# EAGLE schematic MainBoard (EAGLE 6.4)
AUTHOR: Sandor Szilvasi; AUTHOREMAIL: sandor.szilvasi@vanderbilt.edu; PAGE1: Cover page; PAGE10: Connectors; PAGE2: SF supply pins; PAGE3: Clock, reset, JTAG; PAGE4: SF AFE; PAGE5: External AFE #1; PAGE6: External AFE #2; PAGE7: Ethernet; PAGE8: USB and AFE dig.; PAGE9: I/O signals; REVISION: B; TITLE: Teton; VERIFIER: Peter Volgyesi; VERIFIEREMAIL: peter.volgyesi@vanderbilt.edu

## Sheet 1 of 10
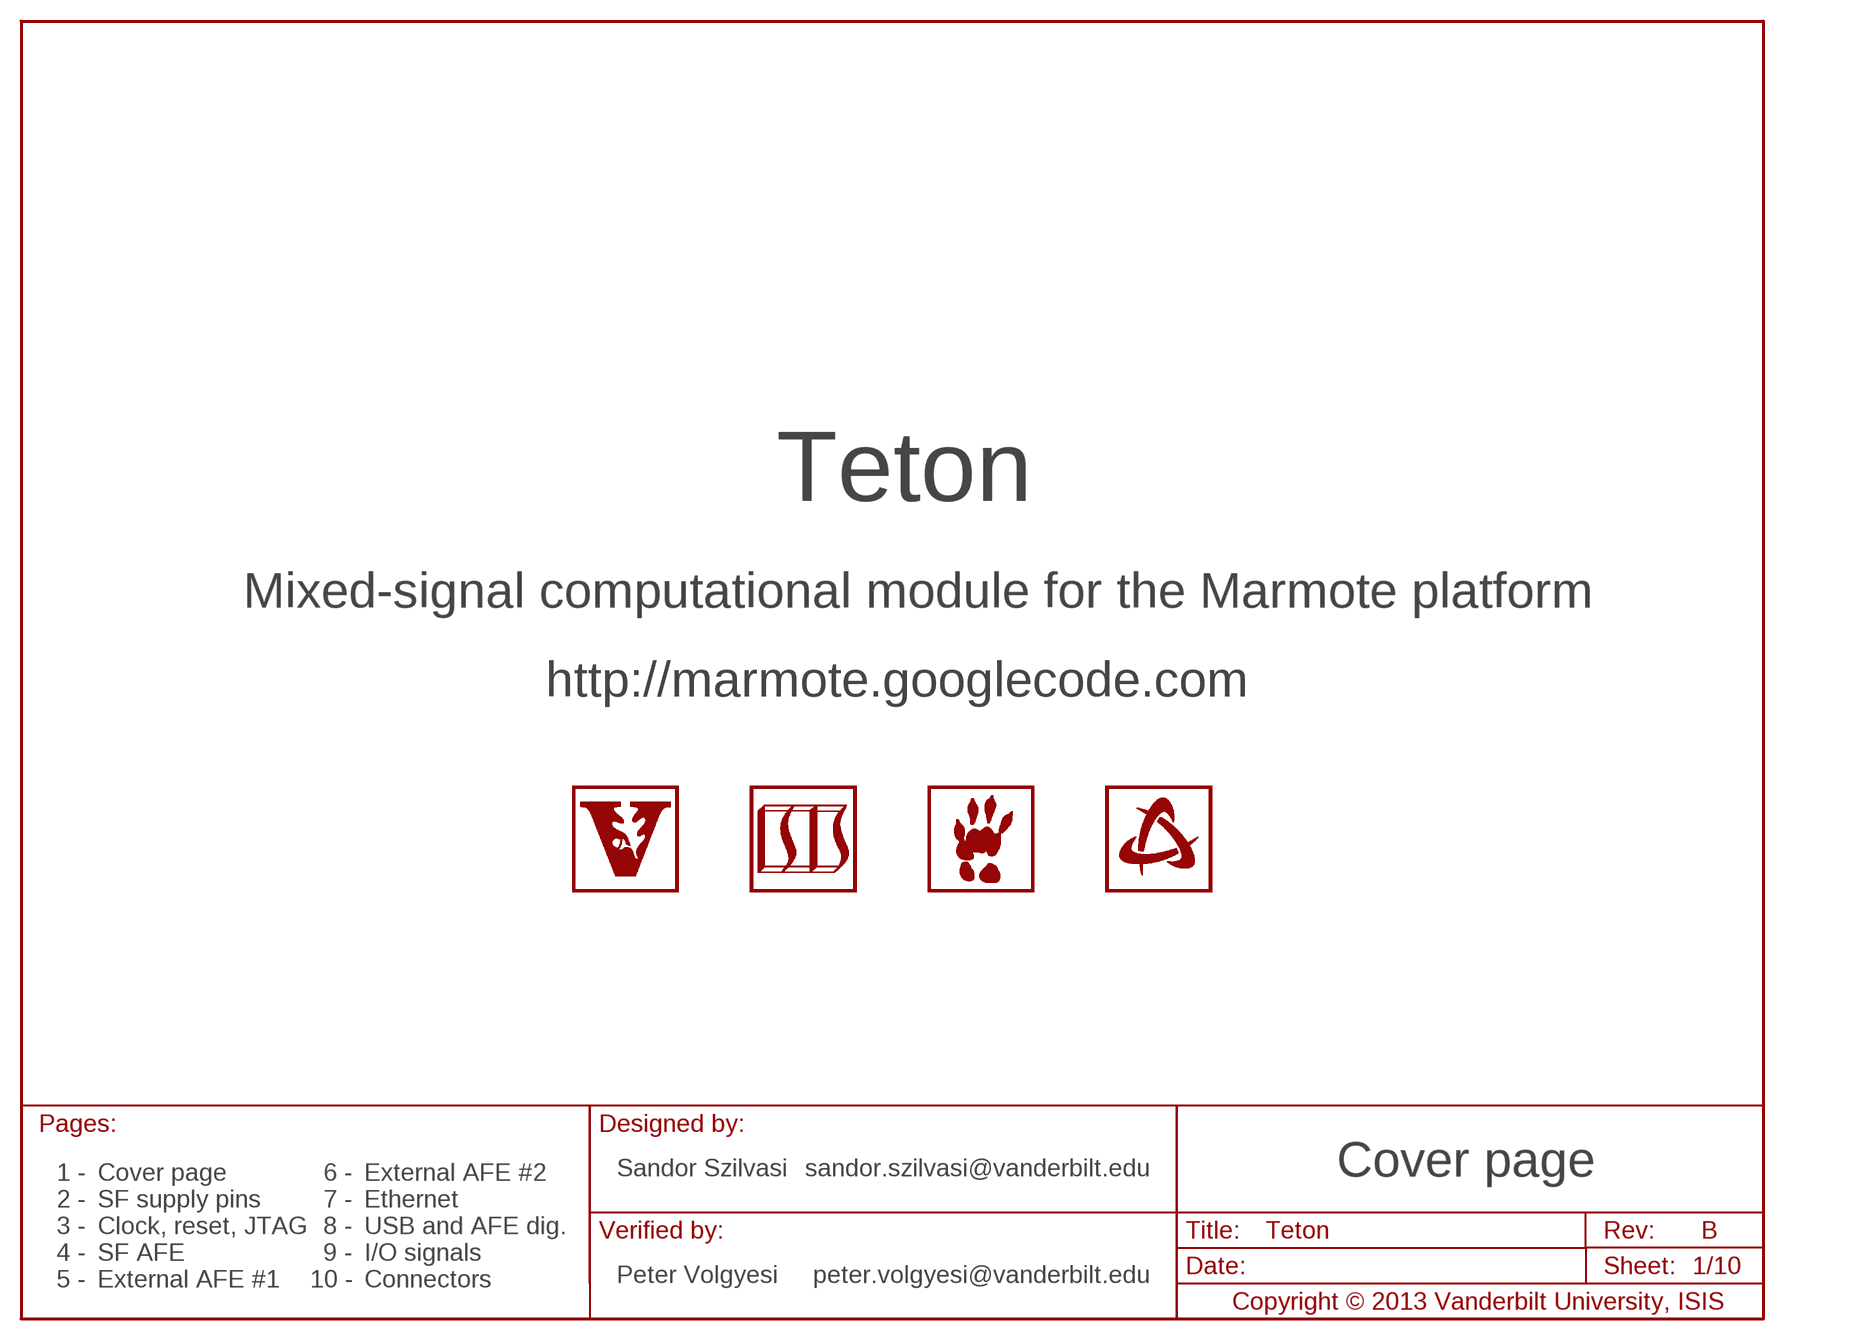
[diagram p0: schematic, sheet 1]

### Parts
LOGO1  LOGO-VANDERBILT-600MIL-10MM-SS  [LOGO-VANDERBILT-10MM-SILKSCREEN]
LOGO2  LOGO-ISIS-600MIL-10MM-SS  [LOGO-ISIS-10MM-SILKSCREEN]
LOGO3  LOGO-MARMOTE-600MIL-10MM-SS  [LOGO-MARMOTE-10MM-SILKSCREEN]
LOGO4  LOGO-SMARTFUSION-600MIL-10MM-SS  [LOGO-SMARTFUSION-10MM-SILKSCREEN]

### Notes on the sheet
- Mixed-signal computational module for the Marmote platform
- http://marmote.googlecode.com
- 1 - | 6 -
- 2 - | 7 -
- 3 - | 8 -
- 4 - | 9 -
- 5 - | 10 -

## Sheet 2 of 10
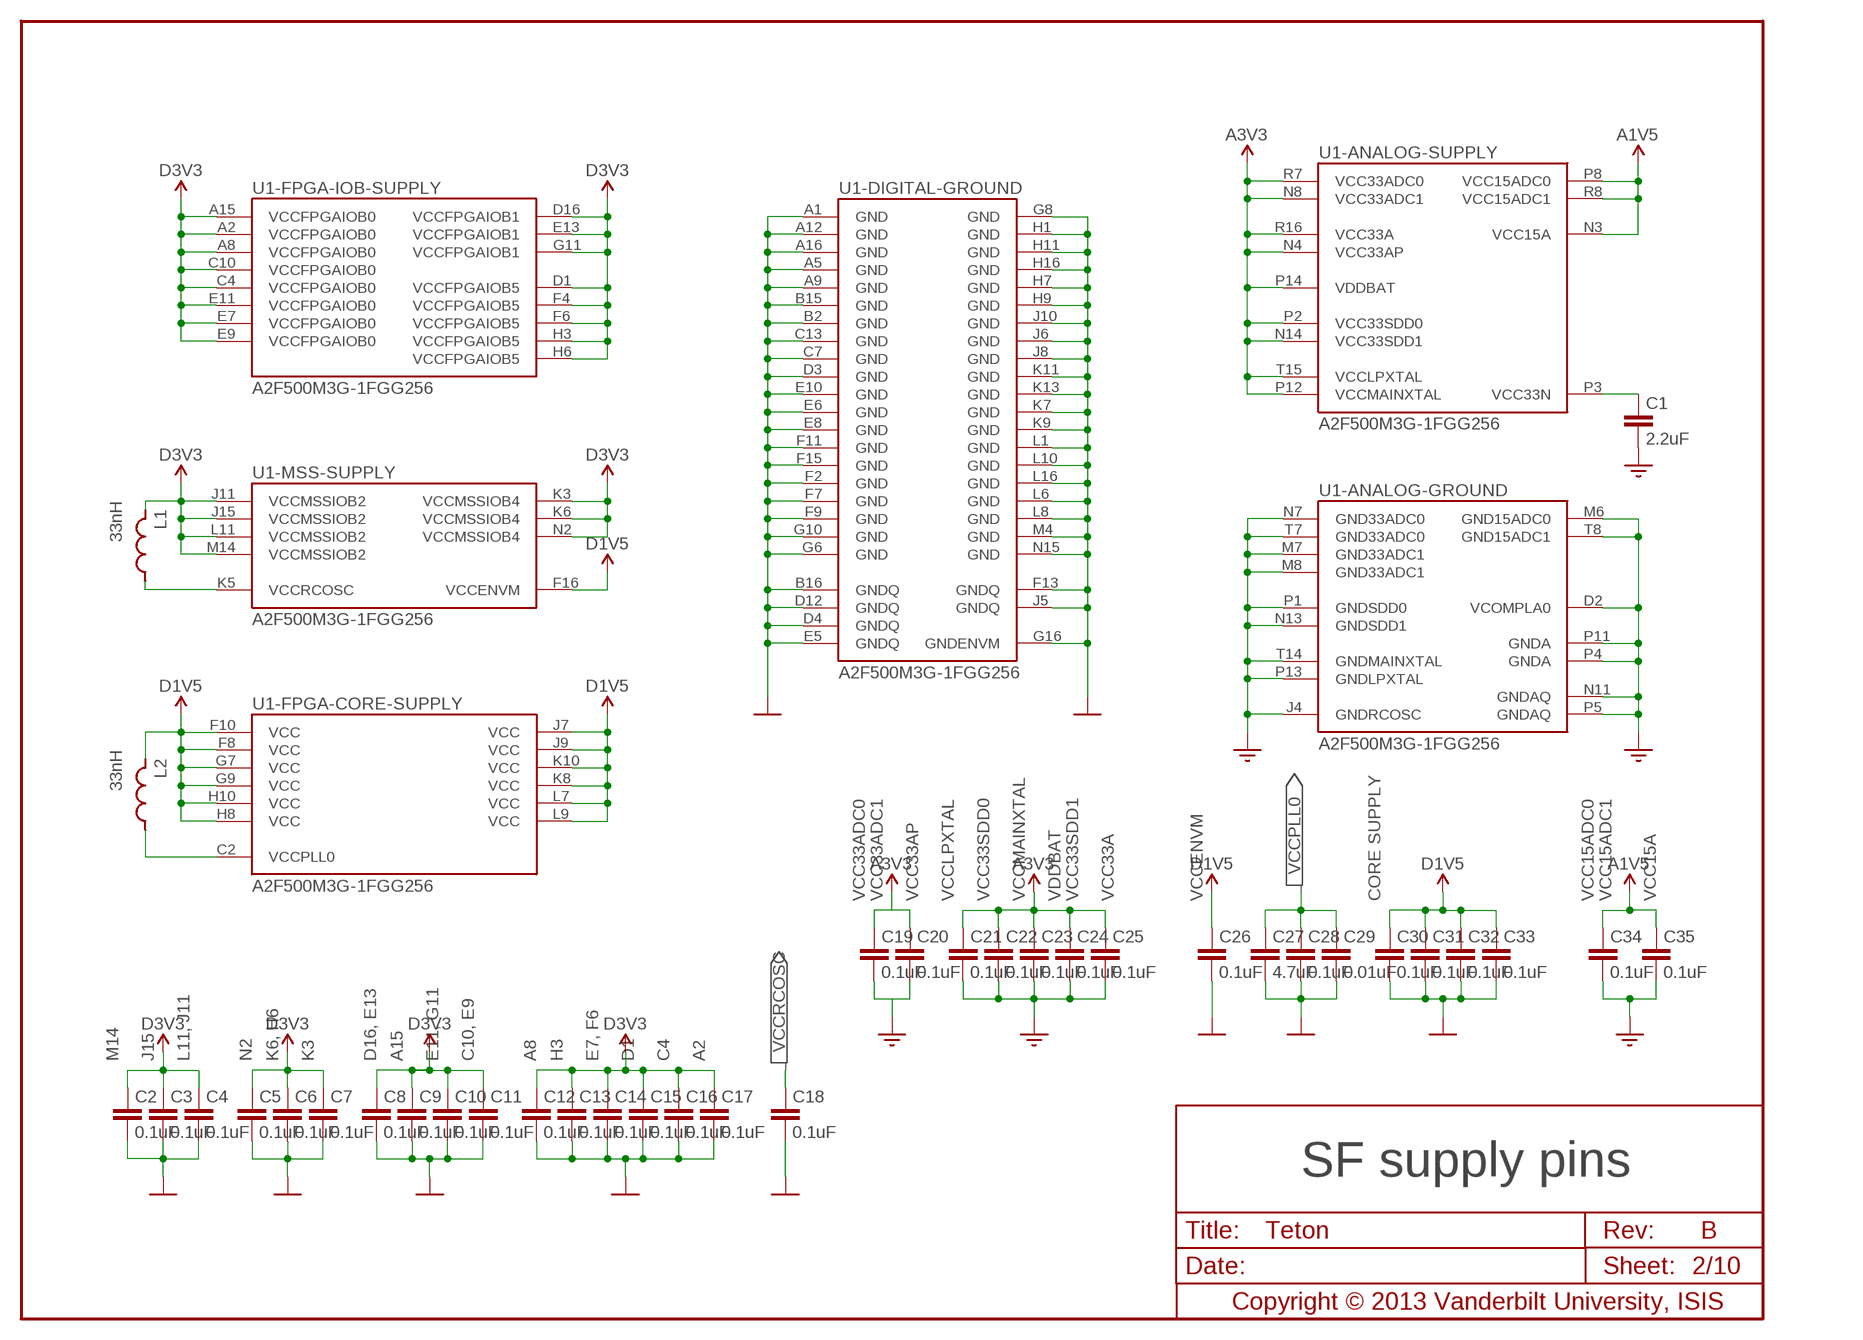
[diagram p1: schematic, sheet 2]

### Parts
C1  2.2uF  C0402  [C0402]
C2  0.1uF  C0402  [C0402]
C3  0.1uF  C0402  [C0402]
C4  0.1uF  C0402  [C0402]
C5  0.1uF  C0402  [C0402]
C6  0.1uF  C0402  [C0402]
C7  0.1uF  C0402  [C0402]
C8  0.1uF  C0402  [C0402]
C9  0.1uF  C0402  [C0402]
C10  0.1uF  C0402  [C0402]
C11  0.1uF  C0402  [C0402]
C12  0.1uF  C0402  [C0402]
C13  0.1uF  C0402  [C0402]
C14  0.1uF  C0402  [C0402]
C15  0.1uF  C0402  [C0402]
C16  0.1uF  C0402  [C0402]
C17  0.1uF  C0402  [C0402]
C18  0.1uF  C0402  [C0402]
C19  0.1uF  C0402  [C0402]
C20  0.1uF  C0402  [C0402]
C21  0.1uF  C0402  [C0402]
C22  0.1uF  C0402  [C0402]
C23  0.1uF  C0402  [C0402]
C24  0.1uF  C0402  [C0402]
C25  0.1uF  C0402  [C0402]
C26  0.1uF  C0402  [C0402]
C27  4.7uF  C0402  [C0402]
C28  0.1uF  C0402  [C0402]
C29  0.01uF  C0402  [C0402]
C30  0.1uF  C0402  [C0402]
C31  0.1uF  C0402  [C0402]
C32  0.1uF  C0402  [C0402]
C33  0.1uF  C0402  [C0402]
C34  0.1uF  C0402  [C0402]
C35  0.1uF  C0402  [C0402]
L1  33nH  L0603  [L0603]
L2  33nH  L0603  [L0603]
U1  A2F500M3G-1FGG256  [FG256]

### Nets
A1V5: C34.1 C35.1 U1.N3(-ANALOG-SUPPLY:VCC15A) U1.P8(-ANALOG-SUPPLY:VCC15ADC0) U1.R8(-ANALOG-SUPPLY:VCC15ADC1) ; also sheet 10
A3V3: C19.1 C20.1 C21.1 C22.1 C23.1 C24.1 C25.1 U1.N4(-ANALOG-SUPPLY:VCC33AP) U1.N8(-ANALOG-SUPPLY:VCC33ADC1) U1.N14(-ANALOG-SUPPLY:VCC33SDD1) U1.P2(-ANALOG-SUPPLY:VCC33SDD0) U1.P12(-ANALOG-SUPPLY:VCCMAINXTAL) U1.P14(-ANALOG-SUPPLY:VDDBAT) U1.R7(-ANALOG-SUPPLY:VCC33ADC0) U1.R16(-ANALOG-SUPPLY:VCC33A) U1.T15(-ANALOG-SUPPLY:VCCLPXTAL) ; also sheet 4,5,6,10
AGND: C1.2 C19.2 C20.2 C21.2 C22.2 C23.2 C24.2 C25.2 C34.2 C35.2 U1.D2(-ANALOG-GROUND:VCOMPLA0) U1.J4(-ANALOG-GROUND:GNDRCOSC) U1.M6(-ANALOG-GROUND:GND15ADC0) U1.M7(-ANALOG-GROUND:GND33ADC1) U1.M8(-ANALOG-GROUND:GND33ADC1) U1.N7(-ANALOG-GROUND:GND33ADC0) U1.N11(-ANALOG-GROUND:GNDAQ) U1.N13(-ANALOG-GROUND:GNDSDD1) U1.P1(-ANALOG-GROUND:GNDSDD0) U1.P4(-ANALOG-GROUND:GNDA) U1.P5(-ANALOG-GROUND:GNDAQ) U1.P11(-ANALOG-GROUND:GNDA) U1.P13(-ANALOG-GROUND:GNDLPXTAL) U1.T7(-ANALOG-GROUND:GND33ADC0) U1.T8(-ANALOG-GROUND:GND15ADC1) U1.T14(-ANALOG-GROUND:GNDMAINXTAL) ; also sheet 3,4,5,6,10
D1V5: C26.1 C30.1 C31.1 C32.1 C33.1 L2.2 U1.F8(-FPGA-CORE-SUPPLY:VCC) U1.F10(-FPGA-CORE-SUPPLY:VCC) U1.F16(-MSS-SUPPLY:VCCENVM) U1.G7(-FPGA-CORE-SUPPLY:VCC) U1.G9(-FPGA-CORE-SUPPLY:VCC) U1.H8(-FPGA-CORE-SUPPLY:VCC) U1.H10(-FPGA-CORE-SUPPLY:VCC) U1.J7(-FPGA-CORE-SUPPLY:VCC) U1.J9(-FPGA-CORE-SUPPLY:VCC) U1.K8(-FPGA-CORE-SUPPLY:VCC) U1.K10(-FPGA-CORE-SUPPLY:VCC) U1.L7(-FPGA-CORE-SUPPLY:VCC) U1.L9(-FPGA-CORE-SUPPLY:VCC) ; also sheet 10
D3V3: C2.1 C3.1 C4.1 C5.1 C6.1 C7.1 C8.1 C9.1 C10.1 C11.1 C12.1 C13.1 C14.1 C15.1 C16.1 C17.1 L1.2 U1.A2(-FPGA-IOB-SUPPLY:VCCFPGAIOB0) U1.A8(-FPGA-IOB-SUPPLY:VCCFPGAIOB0) U1.A15(-FPGA-IOB-SUPPLY:VCCFPGAIOB0) U1.C4(-FPGA-IOB-SUPPLY:VCCFPGAIOB0) U1.C10(-FPGA-IOB-SUPPLY:VCCFPGAIOB0) U1.D1(-FPGA-IOB-SUPPLY:VCCFPGAIOB5) U1.D16(-FPGA-IOB-SUPPLY:VCCFPGAIOB1) U1.E7(-FPGA-IOB-SUPPLY:VCCFPGAIOB0) U1.E9(-FPGA-IOB-SUPPLY:VCCFPGAIOB0) U1.E11(-FPGA-IOB-SUPPLY:VCCFPGAIOB0) U1.E13(-FPGA-IOB-SUPPLY:VCCFPGAIOB1) U1.F4(-FPGA-IOB-SUPPLY:VCCFPGAIOB5) U1.F6(-FPGA-IOB-SUPPLY:VCCFPGAIOB5) U1.G11(-FPGA-IOB-SUPPLY:VCCFPGAIOB1) U1.H3(-FPGA-IOB-SUPPLY:VCCFPGAIOB5) U1.H6(-FPGA-IOB-SUPPLY:VCCFPGAIOB5) U1.J11(-MSS-SUPPLY:VCCMSSIOB2) U1.J15(-MSS-SUPPLY:VCCMSSIOB2) U1.K3(-MSS-SUPPLY:VCCMSSIOB4) U1.K6(-MSS-SUPPLY:VCCMSSIOB4) U1.L11(-MSS-SUPPLY:VCCMSSIOB2) U1.M14(-MSS-SUPPLY:VCCMSSIOB2) U1.N2(-MSS-SUPPLY:VCCMSSIOB4) ; also sheet 3,5,6,7,9,10
DGND: C2.2 C3.2 C4.2 C5.2 C6.2 C7.2 C8.2 C9.2 C10.2 C11.2 C12.2 C13.2 C14.2 C15.2 C16.2 C17.2 C18.2 C26.2 C27.2 C28.2 C29.2 C30.2 C31.2 C32.2 C33.2 U1.A1(-DIGITAL-GROUND:GND) U1.A5(-DIGITAL-GROUND:GND) U1.A9(-DIGITAL-GROUND:GND) U1.A12(-DIGITAL-GROUND:GND) U1.A16(-DIGITAL-GROUND:GND) U1.B2(-DIGITAL-GROUND:GND) U1.B15(-DIGITAL-GROUND:GND) U1.B16(-DIGITAL-GROUND:GNDQ) U1.C7(-DIGITAL-GROUND:GND) U1.C13(-DIGITAL-GROUND:GND) U1.D3(-DIGITAL-GROUND:GND) U1.D4(-DIGITAL-GROUND:GNDQ) U1.D12(-DIGITAL-GROUND:GNDQ) U1.E5(-DIGITAL-GROUND:GNDQ) U1.E6(-DIGITAL-GROUND:GND) U1.E8(-DIGITAL-GROUND:GND) U1.E10(-DIGITAL-GROUND:GND) U1.F2(-DIGITAL-GROUND:GND) U1.F7(-DIGITAL-GROUND:GND) U1.F9(-DIGITAL-GROUND:GND) U1.F11(-DIGITAL-GROUND:GND) U1.F13(-DIGITAL-GROUND:GNDQ) U1.F15(-DIGITAL-GROUND:GND) U1.G6(-DIGITAL-GROUND:GND) U1.G8(-DIGITAL-GROUND:GND) U1.G10(-DIGITAL-GROUND:GND) U1.G16(-DIGITAL-GROUND:GNDENVM) U1.H1(-DIGITAL-GROUND:GND) U1.H7(-DIGITAL-GROUND:GND) U1.H9(-DIGITAL-GROUND:GND) U1.H11(-DIGITAL-GROUND:GND) U1.H16(-DIGITAL-GROUND:GND) U1.J5(-DIGITAL-GROUND:GNDQ) U1.J6(-DIGITAL-GROUND:GND) U1.J8(-DIGITAL-GROUND:GND) U1.J10(-DIGITAL-GROUND:GND) U1.K7(-DIGITAL-GROUND:GND) U1.K9(-DIGITAL-GROUND:GND) U1.K11(-DIGITAL-GROUND:GND) U1.K13(-DIGITAL-GROUND:GND) U1.L1(-DIGITAL-GROUND:GND) U1.L6(-DIGITAL-GROUND:GND) U1.L8(-DIGITAL-GROUND:GND) U1.L10(-DIGITAL-GROUND:GND) U1.L16(-DIGITAL-GROUND:GND) U1.M4(-DIGITAL-GROUND:GND) U1.N15(-DIGITAL-GROUND:GND) ; also sheet 3,5,6,7,8,10
VCC3N: C1.1 U1.P3(-ANALOG-SUPPLY:VCC33N)
VCCPLL0: C27.1 C28.1 C29.1 L2.1 U1.C2(-FPGA-CORE-SUPPLY:VCCPLL0)
VCCRCOSC: C18.1 L1.1 U1.K5(-MSS-SUPPLY:VCCRCOSC)

### Notes on the sheet
- SUP
- VCC33ADC0 | VCC33ADC1 | VCC33AP | VCCLPXTAL | VCC33SDD0 | VCCMAINXTAL | VDDBAT | VCC33SDD1 | VCC33A | VCCENVM | CORE SUPPLY | VCC15ADC0 | VCC15ADC1 | VCC15A
- M14 | J15 | L11, J11 | N2 | K6, H6 | K3 | D16, E13 | A15 | E11, G11 | C10, E9 | A8 | H3 | E7, F6 | D1 | C4 | A2

## Sheet 3 of 10
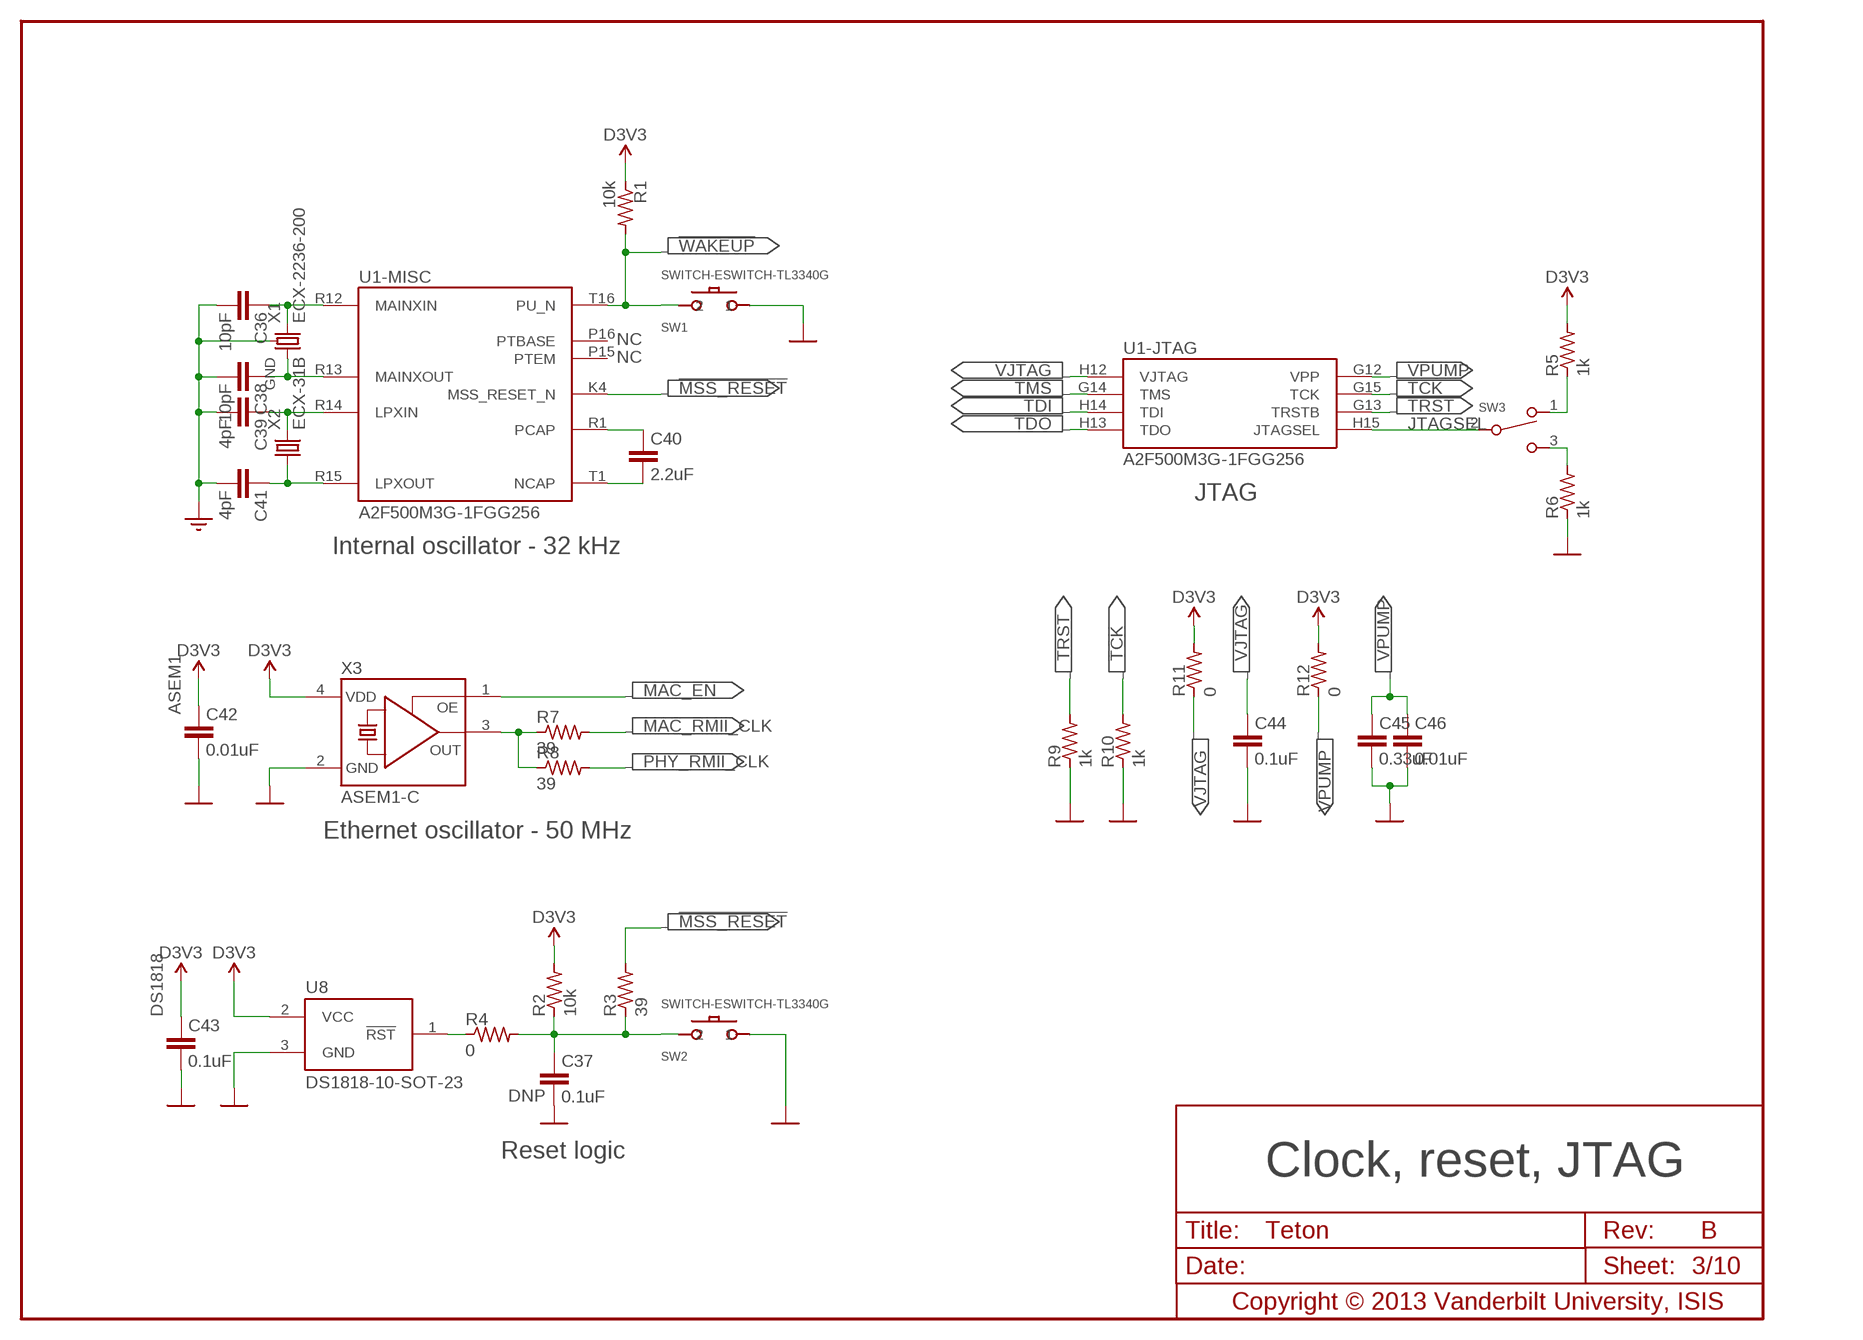
[diagram p2: schematic, sheet 3]

### Parts
C36  10pF  C0402  [C0402]
C37  0.1uF  C0402  [C0402]
C38  10pF  C0402  [C0402]
C39  4pF  C0402  [C0402]
C40  2.2uF  C0402  [C0402]
C41  4pF  C0402  [C0402]
C42  0.01uF  C0402  [C0402]
C43  0.1uF  C0402  [C0402]
C44  0.1uF  C0402  [C0402]
C45  0.33uF  C0402  [C0402]
C46  0.01uF  C0402  [C0402]
R1  10k  R0402  [R0402]
R2  10k  R0402  [R0402]
R3  39  R0402  [R0402]
R4  0  R0402  [R0402]
R5  1k  R0402  [R0402]
R6  1k  R0402  [R0402]
R7  39  R0402  [R0402]
R8  39  R0402  [R0402]
R9  1k  R0402  [R0402]
R10  1k  R0402  [R0402]
R11  0  R0402  [R0402]
R12  0  R0402  [R0402]
SW1  SWITCH-ESWITCH-TL3340G  [TL3340]
SW2  SWITCH-ESWITCH-TL3340G  [TL3340]
SW3  SWITCH-CJS-1200TA  [SWITCH-DIP-CJS]
U8  DS1818-10-SOT-23  [SOT23-3L]
X1  ECX-2236-200  [ECX-2236]
X2  ECX-31B  [ECX-31B]
X3  ASEM1-C  [ASEM1]

### Nets
!MSS_RESET: R3.2 U1.K4(-MISC:MSS_RESET_N) ; also sheet 7
!MSS_RESET_PB: C37.1 R2.1 R3.1 R4.2 SW2.2
!WAKEUP: R1.2 SW1.2 U1.T16(-MISC:PU_N) ; also sheet 10
AGND: C36.2 C38.2 C39.2 C41.2 X1.2(GND) X1.4(GND) ; also sheet 2,4,5,6,10
D3V3: C42.1 C43.1 R1.1 R2.2 R5.2 R11.2 R12.2 U8.2(VCC) X3.4(VDD) ; also sheet 2,5,6,7,9,10
DGND: C37.2 C42.2 C43.2 C44.2 C45.2 C46.2 R6.1 R9.1 R10.1 SW1.1 SW1.3 SW2.1 SW2.3 U8.3(GND) X3.2(GND) ; also sheet 2,5,6,7,8,10
EXTIC-RST: R4.1 U8.1(!RST)
FPGATAP: R5.1 SW3.1
JTAGSEL: SW3.2 U1.H15(-JTAG:JTAGSEL)
LPXIN: C39.1 U1.R14(-MISC:LPXIN) X2.2
LPXOUT: C41.1 U1.R15(-MISC:LPXOUT) X2.1
MAC_EN: X3.1(OE) ; also sheet 7,8
MAC_RMII_CLK: R7.2 ; also sheet 7
MAINXIN: C36.1 U1.R12(-MISC:MAINXIN) X1.3
MAINXOUT: C38.1 U1.R13(-MISC:MAINXOUT) X1.1
MSSTAP: R6.2 SW3.3
NCAP: C40.2 U1.T1(-MISC:NCAP)
PCAP: C40.1 U1.R1(-MISC:PCAP)
PHY_RMII_CLK: R8.2 ; also sheet 7
RMII_CLK: R7.1 R8.1 X3.3(FO)
TCK: R10.2 U1.G15(-JTAG:TCK) ; also sheet 10
TDI: U1.H14(-JTAG:TDI) ; also sheet 10
TDO: U1.H13(-JTAG:TDO) ; also sheet 10
TMS: U1.G14(-JTAG:TMS) ; also sheet 10
TRST: R9.2 U1.G13(-JTAG:TRSTB) ; also sheet 10
VJTAG: C44.1 R11.1 U1.H12(-JTAG:VJTAG) ; also sheet 10
VPUMP: C45.1 C46.1 R12.1 U1.G12(-JTAG:VPP) ; also sheet 10
Unconnected: U1.P15(-MISC:PTEM) U1.P16(-MISC:PTBASE)

### Notes on the sheet
- NC
- NC
- JTAG
- Internal oscillator - 32 kHz
- CLK
- ASEM1
- Ethernet oscillator - 50 MHz
- DS1818
- RST
- Reset logic

## Sheet 4 of 10
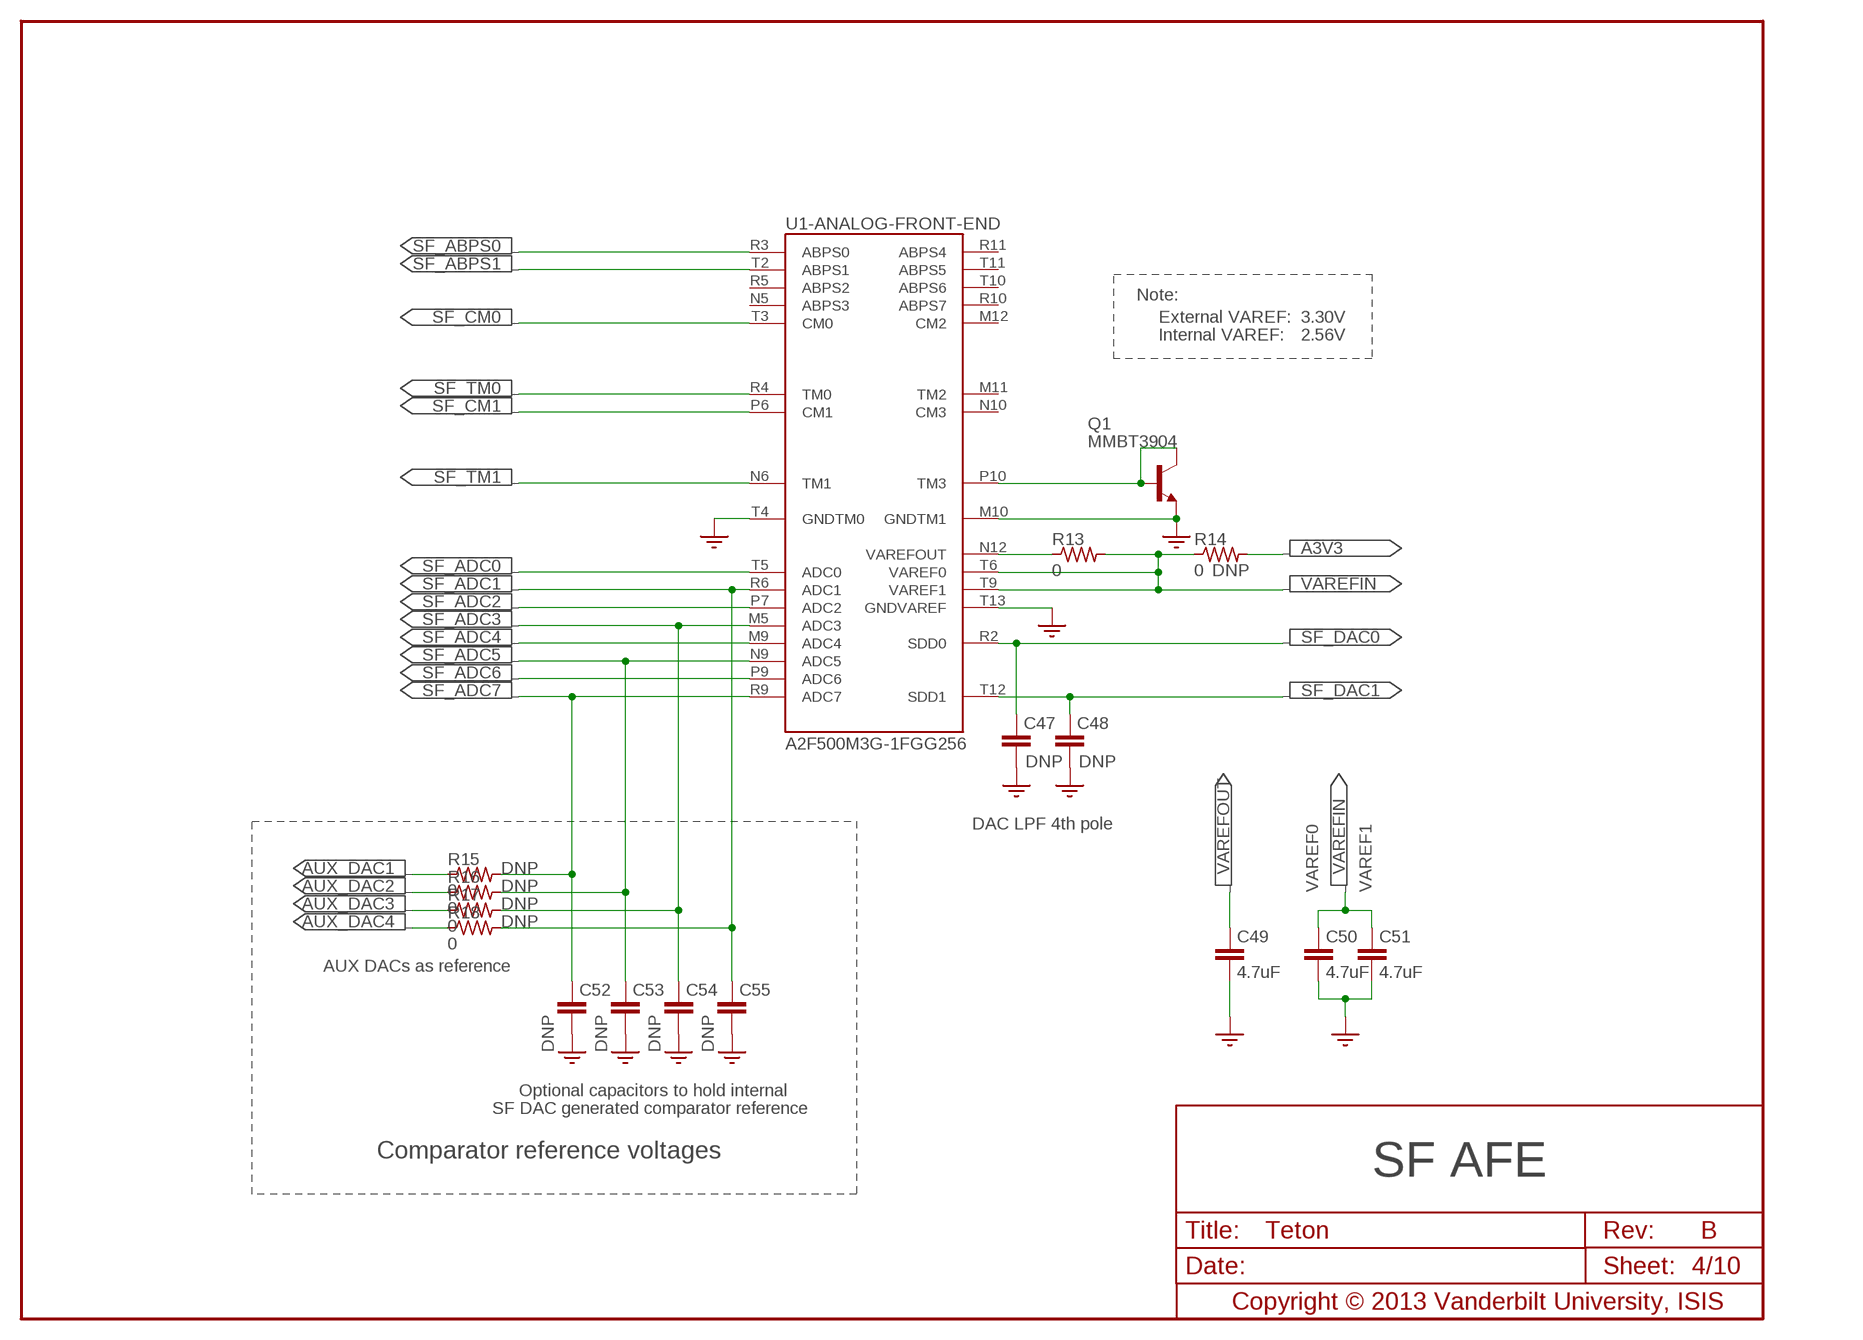
[diagram p3: schematic, sheet 4]

### Parts
C47  C0402  [C0402]
C48  C0402  [C0402]
C49  4.7uF  C0402  [C0402]
C50  4.7uF  C0402  [C0402]
C51  4.7uF  C0402  [C0402]
C52  C0402  [C0402]
C53  C0402  [C0402]
C54  C0402  [C0402]
C55  C0402  [C0402]
Q1  MMBT3904  [SOT23-3L]
R13  0  R0402  [R0402]
R14  0  R0402  [R0402]
R15  0  R0402  [R0402]
R16  0  R0402  [R0402]
R17  0  R0402  [R0402]
R18  0  R0402  [R0402]

### Nets
A3V3: R14.2 ; also sheet 2,5,6,10
AGND: C47.2 C48.2 C49.2 C50.2 C51.2 C52.2 C53.2 C54.2 C55.2 Q1.2(E) U1.M10(-ANALOG-FRONT-END:GNDTM1) U1.T4(-ANALOG-FRONT-END:GNDTM0) U1.T13(-ANALOG-FRONT-END:GNDVAREF) ; also sheet 2,3,5,6,10
AUX_DAC1: R15.1 ; also sheet 5
AUX_DAC2: R16.1 ; also sheet 5
AUX_DAC3: R17.1 ; also sheet 6
AUX_DAC4: R18.1 ; also sheet 6
SF_ABPS0: U1.R3(-ANALOG-FRONT-END:ABPS0) ; also sheet 10
SF_ABPS1: U1.T2(-ANALOG-FRONT-END:ABPS1) ; also sheet 10
SF_ADC0: U1.T5(-ANALOG-FRONT-END:ADC0) ; also sheet 10
SF_ADC1: C55.1 R18.2 U1.R6(-ANALOG-FRONT-END:ADC1) ; also sheet 10
SF_ADC2: U1.P7(-ANALOG-FRONT-END:ADC2) ; also sheet 10
SF_ADC3: C54.1 R17.2 U1.M5(-ANALOG-FRONT-END:ADC3) ; also sheet 10
SF_ADC4: U1.M9(-ANALOG-FRONT-END:ADC4) ; also sheet 10
SF_ADC5: C53.1 R16.2 U1.N9(-ANALOG-FRONT-END:ADC5) ; also sheet 10
SF_ADC6: U1.P9(-ANALOG-FRONT-END:ADC6) ; also sheet 10
SF_ADC7: C52.1 R15.2 U1.R9(-ANALOG-FRONT-END:ADC7) ; also sheet 10
SF_CM0: U1.T3(-ANALOG-FRONT-END:CM0) ; also sheet 10
SF_CM1: U1.P6(-ANALOG-FRONT-END:CM1) ; also sheet 10
SF_DAC0: C47.1 U1.R2(-ANALOG-FRONT-END:SDD0) ; also sheet 10
SF_DAC1: C48.1 U1.T12(-ANALOG-FRONT-END:SDD1) ; also sheet 10
SF_TM0: U1.R4(-ANALOG-FRONT-END:TM0) ; also sheet 10
SF_TM1: U1.N6(-ANALOG-FRONT-END:TM1) ; also sheet 10
SF_TM3: Q1.1(B) Q1.3(C) U1.P10(-ANALOG-FRONT-END:TM3)
VAREFIN: C50.1 C51.1 R13.2 R14.1 U1.T6(-ANALOG-FRONT-END:VAREF0) U1.T9(-ANALOG-FRONT-END:VAREF1)
VAREFOUT: C49.1 R13.1 U1.N12(-ANALOG-FRONT-END:VAREFOUT)
Unconnected: U1.M11(-ANALOG-FRONT-END:TM2) U1.M12(-ANALOG-FRONT-END:CM2) U1.N5(-ANALOG-FRONT-END:ABPS3) U1.N10(-ANALOG-FRONT-END:CM3) U1.R5(-ANALOG-FRONT-END:ABPS2) U1.R10(-ANALOG-FRONT-END:ABPS7) U1.R11(-ANALOG-FRONT-END:ABPS4) U1.T10(-ANALOG-FRONT-END:ABPS6) U1.T11(-ANALOG-FRONT-END:ABPS5)

### Notes on the sheet
- Note:
- External VAREF: | 3.30V
- Internal VAREF: | 2.56V
- SF
- DAC LPF 4th pole
- VAREF0 | VAREF1
- AUX DACs as reference
- AFE
- Optional capacitors to hold internal
- SF DAC generated comparator reference
- Comparator reference voltages

## Sheet 5 of 10
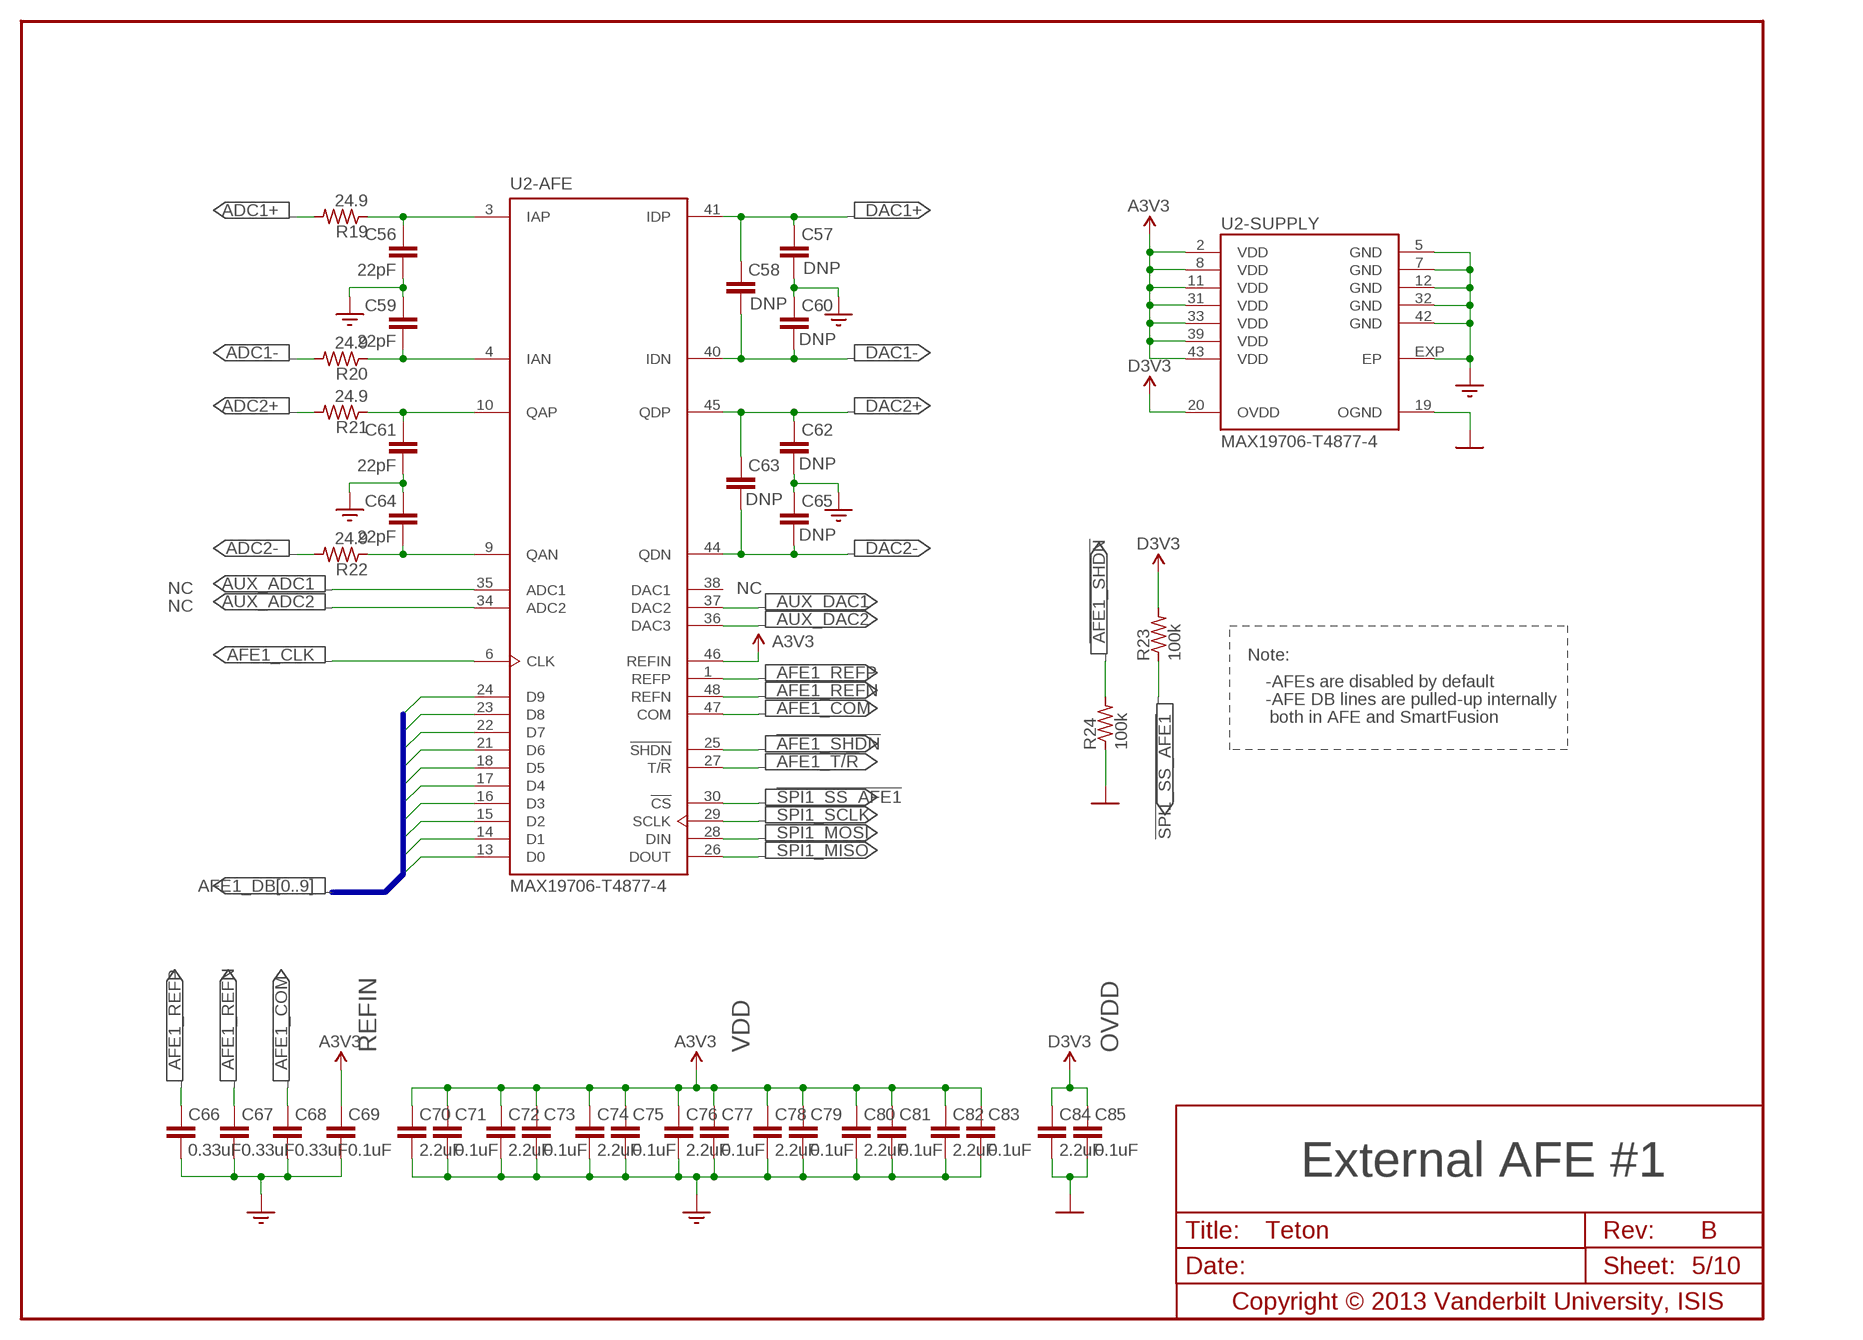
[diagram p4: schematic, sheet 5]

### Parts
C56  22pF  C0402  [C0402]
C57  C0402  [C0402]
C58  C0402  [C0402]
C59  22pF  C0402  [C0402]
C60  C0402  [C0402]
C61  22pF  C0402  [C0402]
C62  C0402  [C0402]
C63  C0402  [C0402]
C64  22pF  C0402  [C0402]
C65  C0402  [C0402]
C66  0.33uF  C0402  [C0402]
C67  0.33uF  C0402  [C0402]
C68  0.33uF  C0402  [C0402]
C69  0.1uF  C0402  [C0402]
C70  2.2uF  C0402  [C0402]
C71  0.1uF  C0402  [C0402]
C72  2.2uF  C0402  [C0402]
C73  0.1uF  C0402  [C0402]
C74  2.2uF  C0402  [C0402]
C75  0.1uF  C0402  [C0402]
C76  2.2uF  C0402  [C0402]
C77  0.1uF  C0402  [C0402]
C78  2.2uF  C0402  [C0402]
C79  0.1uF  C0402  [C0402]
C80  2.2uF  C0402  [C0402]
C81  0.1uF  C0402  [C0402]
C82  2.2uF  C0402  [C0402]
C83  0.1uF  C0402  [C0402]
C84  2.2uF  C0402  [C0402]
C85  0.1uF  C0402  [C0402]
R19  24.9  R0402  [R0402]
R20  24.9  R0402  [R0402]
R21  24.9  R0402  [R0402]
R22  24.9  R0402  [R0402]
R23  100k  R0402  [R0402]
R24  100k  R0402  [R0402]
U2  MAX19706-T4877-4  [TQFN-48]

### Nets
!AFE1_SHDN: R24.2 U2.25(-AFE:!SHDN) ; also sheet 8
!SPI1_SS_AFE1: R23.1 U2.30(-AFE:!CS) ; also sheet 9
A3V3: C69.1 C70.1 C71.1 C72.1 C73.1 C74.1 C75.1 C76.1 C77.1 C78.1 C79.1 C80.1 C81.1 C82.1 C83.1 U2.2(-SUPPLY:VDD) U2.8(-SUPPLY:VDD) U2.11(-SUPPLY:VDD) U2.31(-SUPPLY:VDD) U2.33(-SUPPLY:VDD) U2.39(-SUPPLY:VDD) U2.43(-SUPPLY:VDD) U2.46(-AFE:REFIN) ; also sheet 2,4,6,10
ADC1+: R19.2 ; also sheet 10
ADC1-: R20.2 ; also sheet 10
ADC1-IAN: C59.2 R20.1 U2.4(-AFE:IAN)
ADC1-IAP: C56.1 R19.1 U2.3(-AFE:IAP)
ADC2+: R21.2 ; also sheet 10
ADC2-: R22.2 ; also sheet 10
ADC2-QAN: C64.2 R22.1 U2.9(-AFE:QAN)
ADC2-QAP: C61.1 R21.1 U2.10(-AFE:QAP)
AFE1_CLK: U2.6(-AFE:CLK) ; also sheet 8
AFE1_COM: C68.1 U2.47(-AFE:COM)
AFE1_DB0: U2.13(-AFE:D0) ; also sheet 8
AFE1_DB1: U2.14(-AFE:D1) ; also sheet 8
AFE1_DB2: U2.15(-AFE:D2) ; also sheet 8
AFE1_DB3: U2.16(-AFE:D3) ; also sheet 8
AFE1_DB4: U2.17(-AFE:D4) ; also sheet 8
AFE1_DB5: U2.18(-AFE:D5) ; also sheet 8
AFE1_DB6: U2.21(-AFE:D6) ; also sheet 8
AFE1_DB7: U2.22(-AFE:D7) ; also sheet 8
AFE1_DB8: U2.23(-AFE:D8) ; also sheet 8
AFE1_DB9: U2.24(-AFE:D9) ; also sheet 8
AFE1_REFN: C67.1 U2.48(-AFE:REFN)
AFE1_REFP: C66.1 U2.1(-AFE:REFP)
AFE1_T/!R: U2.27(-AFE:T/!R) ; also sheet 8
AGND: C56.2 C57.2 C59.1 C60.1 C61.2 C62.2 C64.1 C65.1 C66.2 C67.2 C68.2 C69.2 C70.2 C71.2 C72.2 C73.2 C74.2 C75.2 C76.2 C77.2 C78.2 C79.2 C80.2 C81.2 C82.2 C83.2 U2.5(-SUPPLY:GND) U2.7(-SUPPLY:GND) U2.12(-SUPPLY:GND) U2.32(-SUPPLY:GND) U2.42(-SUPPLY:GND) U2.EXP(-SUPPLY:EP) ; also sheet 2,3,4,6,10
AUX_ADC1: U2.35(-AFE:ADC1)
AUX_ADC2: U2.34(-AFE:ADC2)
AUX_DAC1: U2.37(-AFE:DAC2) ; also sheet 4
AUX_DAC2: U2.36(-AFE:DAC3) ; also sheet 4
D3V3: C84.1 C85.1 R23.2 U2.20(-SUPPLY:OVDD) ; also sheet 2,3,6,7,9,10
DAC1+: C57.1 C58.1 U2.41(-AFE:IDP) ; also sheet 10
DAC1-: C58.2 C60.2 U2.40(-AFE:IDN) ; also sheet 10
DAC2+: C62.1 C63.1 U2.45(-AFE:QDP) ; also sheet 10
DAC2-: C63.2 C65.2 U2.44(-AFE:QDN) ; also sheet 10
DGND: C84.2 C85.2 R24.1 U2.19(-SUPPLY:OGND) ; also sheet 2,3,6,7,8,10
SPI1_MISO: U2.26(-AFE:DOUT) ; also sheet 6,9,10
SPI1_MOSI: U2.28(-AFE:DIN) ; also sheet 6,9,10
SPI1_SCLK: U2.29(-AFE:SCLK) ; also sheet 6,9,10
Unconnected: U2.38(-AFE:DAC1)

### Buses
AFE1_DB[0..9]

### Notes on the sheet
- NC | EXT | NC
- NC
- Note:
- -AFEs are disabled by default
- -AFE DB lines are pulled-up internally
- both in AFE and SmartFusion
- REFIN | VDD | OVDD
- AFE1

## Sheet 6 of 10
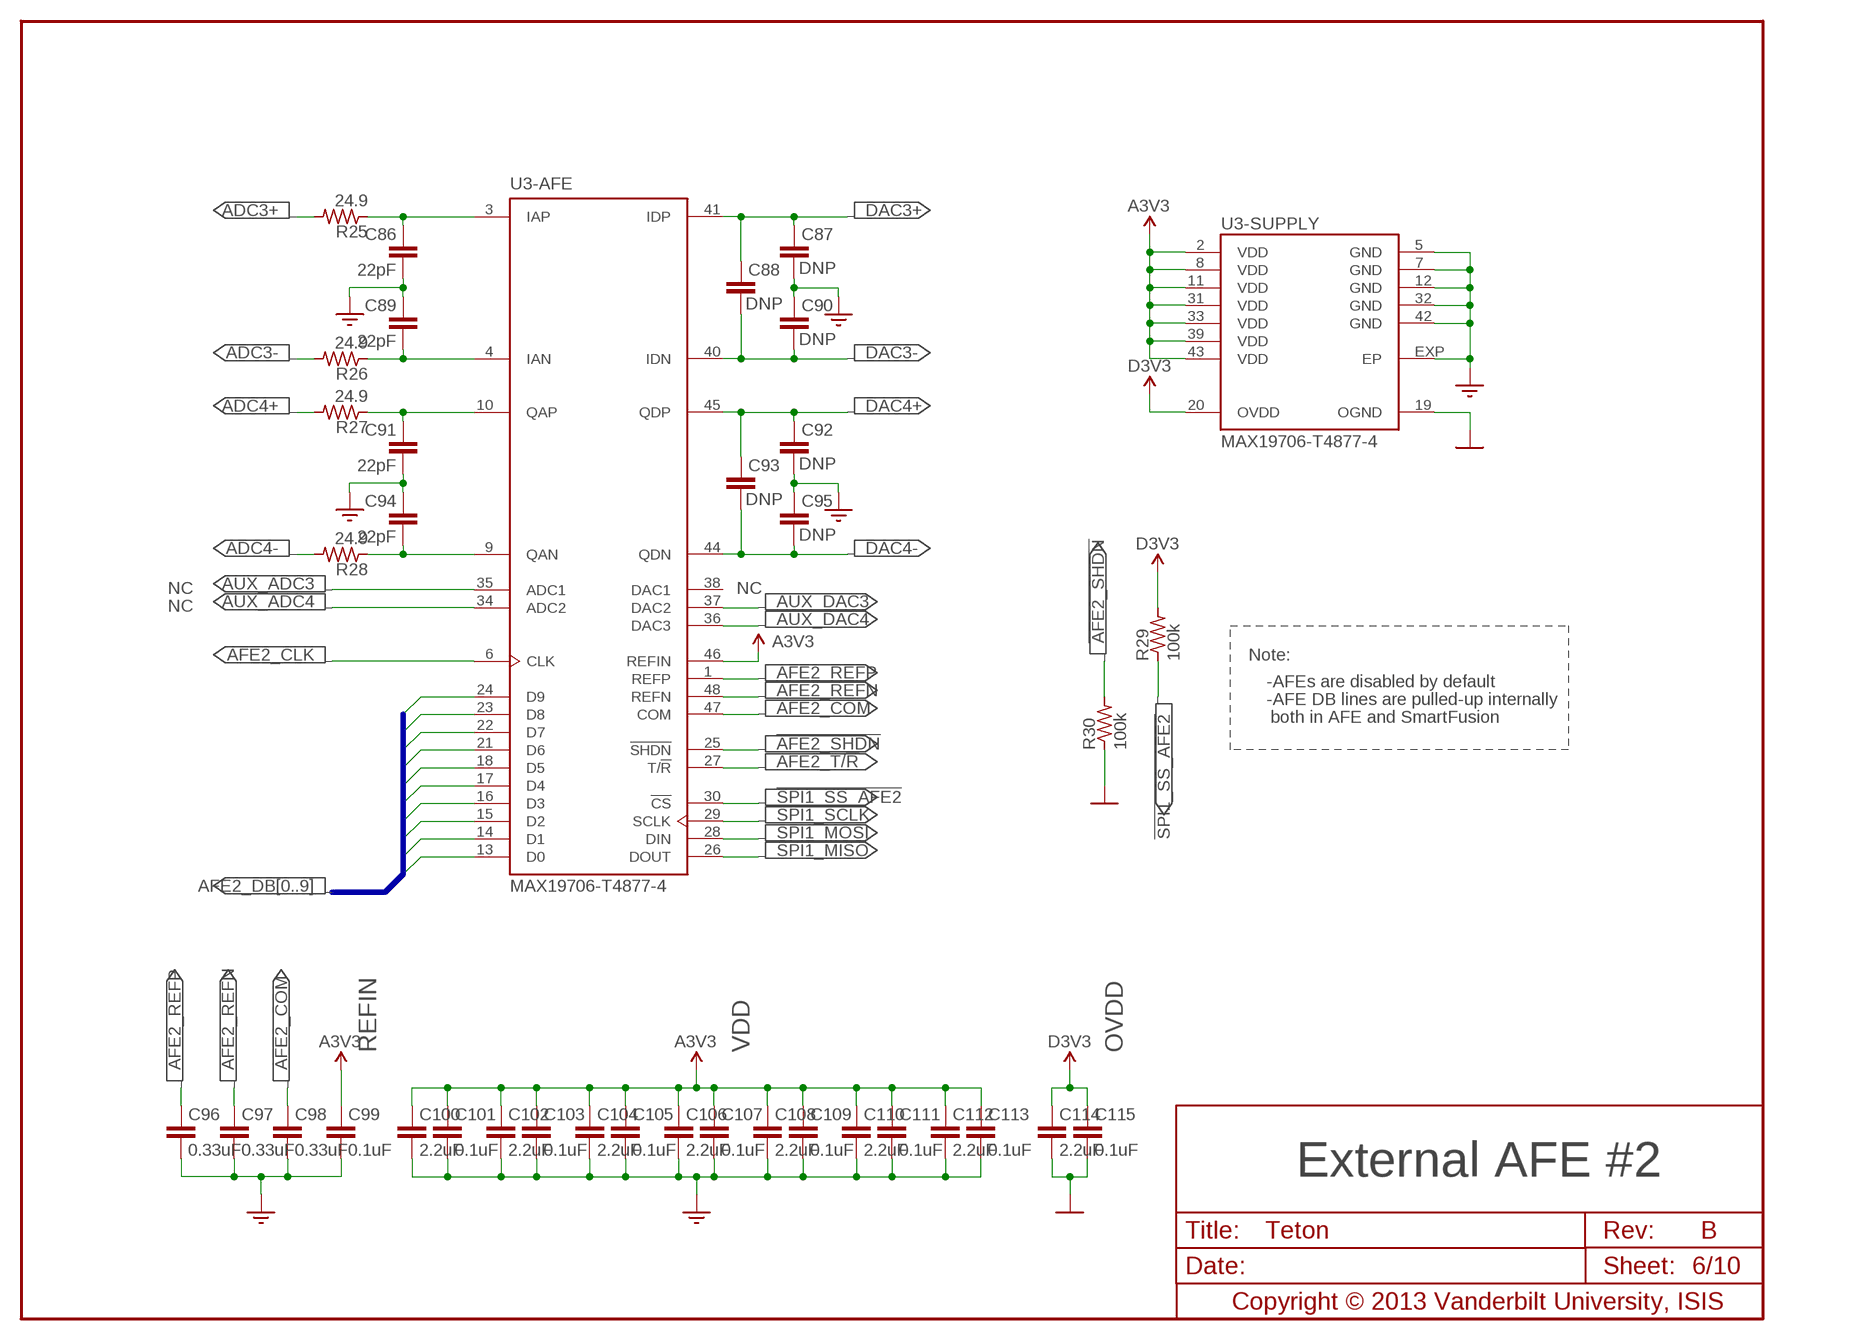
[diagram p5: schematic, sheet 6]

### Parts
C86  22pF  C0402  [C0402]
C87  C0402  [C0402]
C88  C0402  [C0402]
C89  22pF  C0402  [C0402]
C90  C0402  [C0402]
C91  22pF  C0402  [C0402]
C92  C0402  [C0402]
C93  C0402  [C0402]
C94  22pF  C0402  [C0402]
C95  C0402  [C0402]
C96  0.33uF  C0402  [C0402]
C97  0.33uF  C0402  [C0402]
C98  0.33uF  C0402  [C0402]
C99  0.1uF  C0402  [C0402]
C100  2.2uF  C0402  [C0402]
C101  0.1uF  C0402  [C0402]
C102  2.2uF  C0402  [C0402]
C103  0.1uF  C0402  [C0402]
C104  2.2uF  C0402  [C0402]
C105  0.1uF  C0402  [C0402]
C106  2.2uF  C0402  [C0402]
C107  0.1uF  C0402  [C0402]
C108  2.2uF  C0402  [C0402]
C109  0.1uF  C0402  [C0402]
C110  2.2uF  C0402  [C0402]
C111  0.1uF  C0402  [C0402]
C112  2.2uF  C0402  [C0402]
C113  0.1uF  C0402  [C0402]
C114  2.2uF  C0402  [C0402]
C115  0.1uF  C0402  [C0402]
R25  24.9  R0402  [R0402]
R26  24.9  R0402  [R0402]
R27  24.9  R0402  [R0402]
R28  24.9  R0402  [R0402]
R29  100k  R0402  [R0402]
R30  100k  R0402  [R0402]
U3  MAX19706-T4877-4  [TQFN-48]

### Nets
!AFE2_SHDN: R30.2 U3.25(-AFE:!SHDN) ; also sheet 8
!SPI1_SS_AFE2: R29.1 U3.30(-AFE:!CS) ; also sheet 8
A3V3: C99.1 C100.1 C101.1 C102.1 C103.1 C104.1 C105.1 C106.1 C107.1 C108.1 C109.1 C110.1 C111.1 C112.1 C113.1 U3.2(-SUPPLY:VDD) U3.8(-SUPPLY:VDD) U3.11(-SUPPLY:VDD) U3.31(-SUPPLY:VDD) U3.33(-SUPPLY:VDD) U3.39(-SUPPLY:VDD) U3.43(-SUPPLY:VDD) U3.46(-AFE:REFIN) ; also sheet 2,4,5,10
ADC3+: R25.2 ; also sheet 10
ADC3-: R26.2 ; also sheet 10
ADC3-IAN: C89.2 R26.1 U3.4(-AFE:IAN)
ADC3-IAP: C86.1 R25.1 U3.3(-AFE:IAP)
ADC4+: R27.2 ; also sheet 10
ADC4-: R28.2 ; also sheet 10
ADC4-QAN: C94.2 R28.1 U3.9(-AFE:QAN)
ADC4-QAP: C91.1 R27.1 U3.10(-AFE:QAP)
AFE2_CLK: U3.6(-AFE:CLK) ; also sheet 8
AFE2_COM: C98.1 U3.47(-AFE:COM)
AFE2_DB0: U3.13(-AFE:D0) ; also sheet 8
AFE2_DB1: U3.14(-AFE:D1) ; also sheet 8
AFE2_DB2: U3.15(-AFE:D2) ; also sheet 8
AFE2_DB3: U3.16(-AFE:D3) ; also sheet 8
AFE2_DB4: U3.17(-AFE:D4) ; also sheet 8
AFE2_DB5: U3.18(-AFE:D5) ; also sheet 8
AFE2_DB6: U3.21(-AFE:D6) ; also sheet 8
AFE2_DB7: U3.22(-AFE:D7) ; also sheet 8
AFE2_DB8: U3.23(-AFE:D8) ; also sheet 8
AFE2_DB9: U3.24(-AFE:D9) ; also sheet 8
AFE2_REFN: C97.1 U3.48(-AFE:REFN)
AFE2_REFP: C96.1 U3.1(-AFE:REFP)
AFE2_T/!R: U3.27(-AFE:T/!R) ; also sheet 8
AGND: C86.2 C87.2 C89.1 C90.1 C91.2 C92.2 C94.1 C95.1 C96.2 C97.2 C98.2 C99.2 C100.2 C101.2 C102.2 C103.2 C104.2 C105.2 C106.2 C107.2 C108.2 C109.2 C110.2 C111.2 C112.2 C113.2 U3.5(-SUPPLY:GND) U3.7(-SUPPLY:GND) U3.12(-SUPPLY:GND) U3.32(-SUPPLY:GND) U3.42(-SUPPLY:GND) U3.EXP(-SUPPLY:EP) ; also sheet 2,3,4,5,10
AUX_ADC3: U3.35(-AFE:ADC1)
AUX_ADC4: U3.34(-AFE:ADC2)
AUX_DAC3: U3.37(-AFE:DAC2) ; also sheet 4
AUX_DAC4: U3.36(-AFE:DAC3) ; also sheet 4
D3V3: C114.1 C115.1 R29.2 U3.20(-SUPPLY:OVDD) ; also sheet 2,3,5,7,9,10
DAC3+: C87.1 C88.1 U3.41(-AFE:IDP) ; also sheet 10
DAC3-: C88.2 C90.2 U3.40(-AFE:IDN) ; also sheet 10
DAC4+: C92.1 C93.1 U3.45(-AFE:QDP) ; also sheet 10
DAC4-: C93.2 C95.2 U3.44(-AFE:QDN) ; also sheet 10
DGND: C114.2 C115.2 R30.1 U3.19(-SUPPLY:OGND) ; also sheet 2,3,5,7,8,10
SPI1_MISO: U3.26(-AFE:DOUT) ; also sheet 5,9,10
SPI1_MOSI: U3.28(-AFE:DIN) ; also sheet 5,9,10
SPI1_SCLK: U3.29(-AFE:SCLK) ; also sheet 5,9,10
Unconnected: U3.38(-AFE:DAC1)

### Buses
AFE2_DB[0..9]

### Notes on the sheet
- NC | EXT | NC
- NC
- Note:
- -AFEs are disabled by default
- -AFE DB lines are pulled-up internally
- both in AFE and SmartFusion
- REFIN | VDD | OVDD
- AFE2

## Sheet 7 of 10
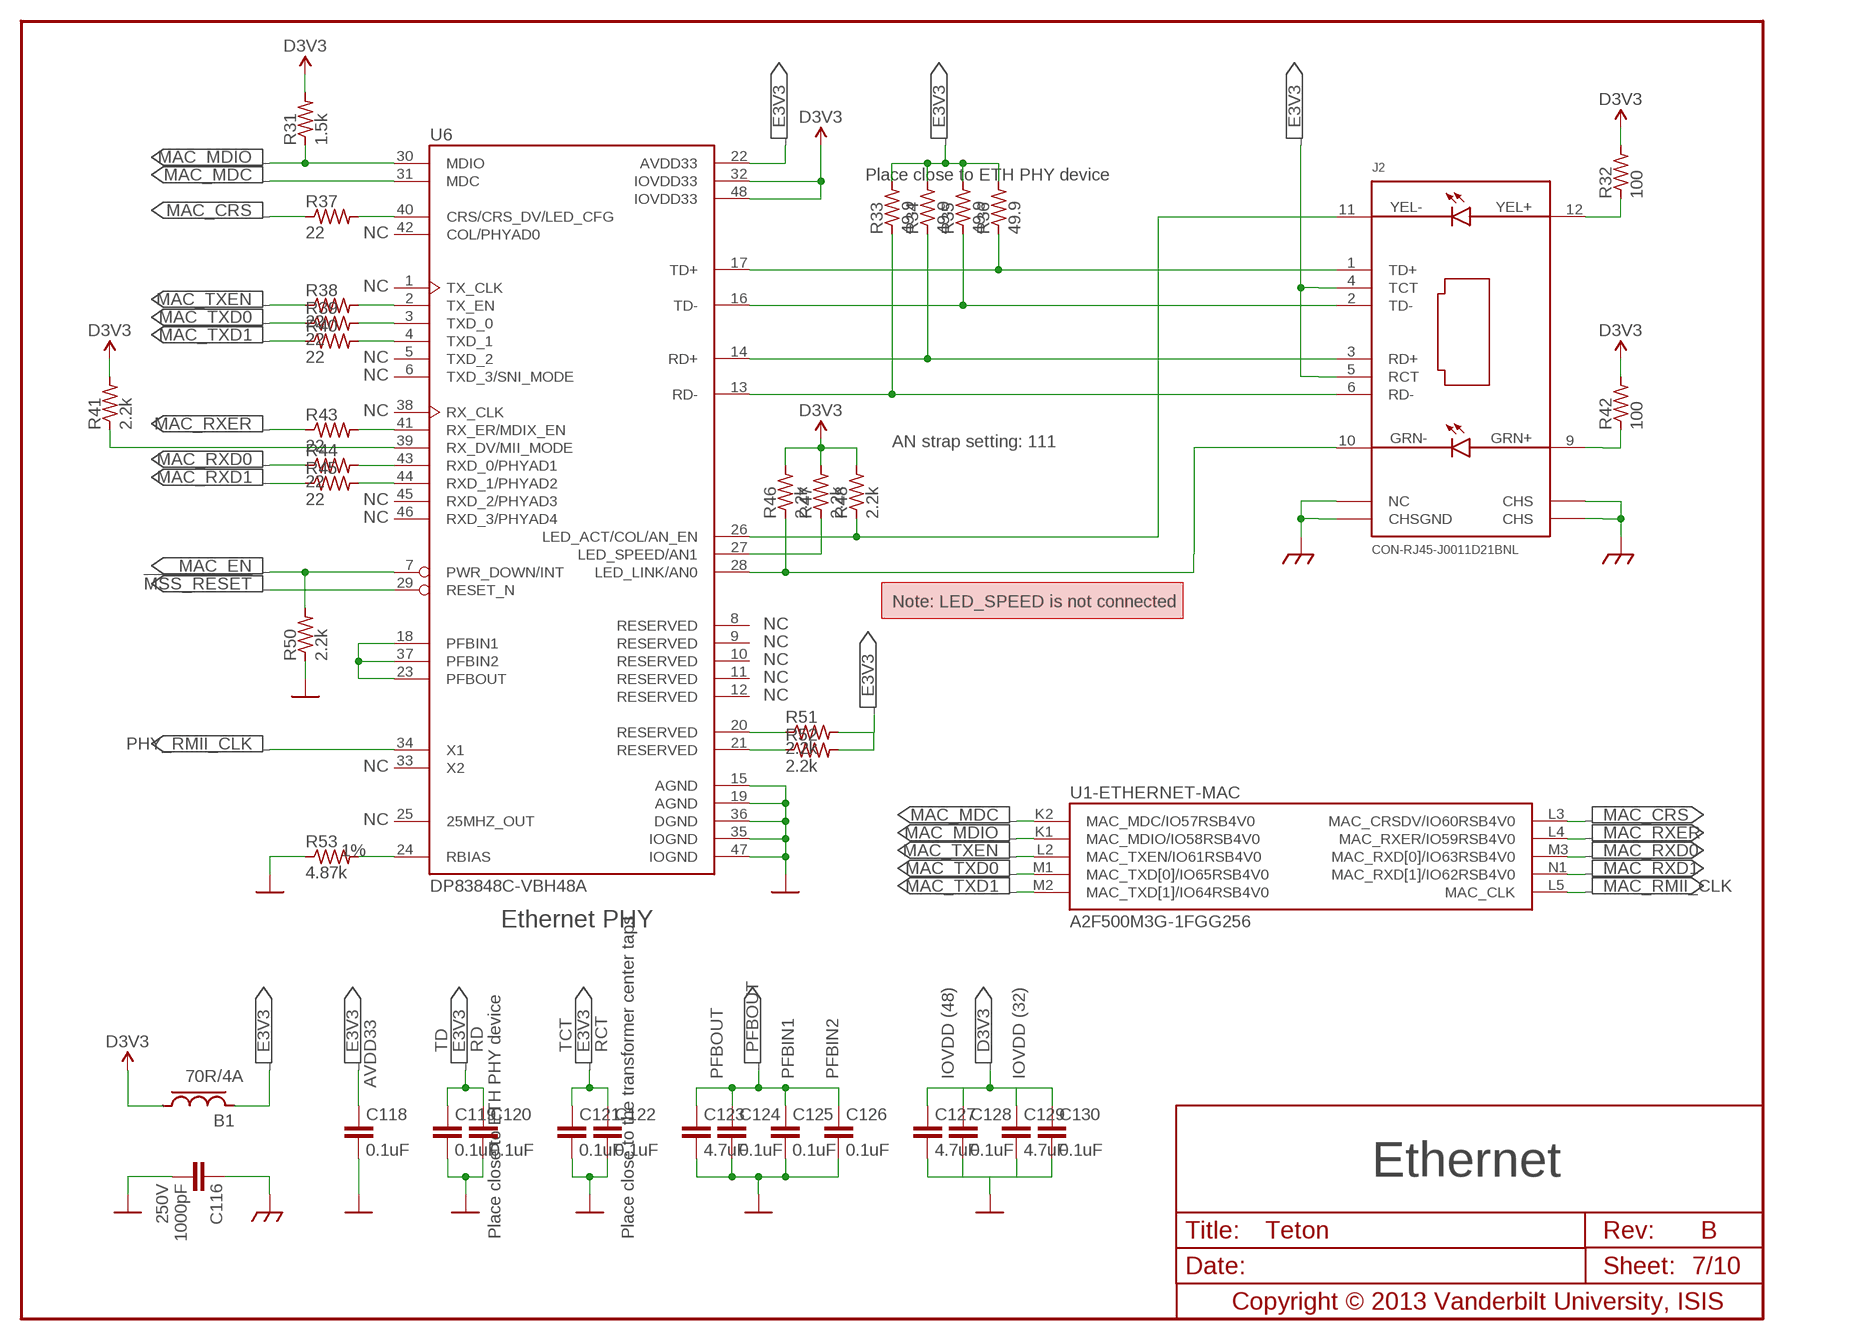
[diagram p6: schematic, sheet 7]

### Parts
B1  70R/4A  BEAD-BLM18SG700TN1D0603  [L0603]
C116  1000pF  C0805  [C0805]
C118  0.1uF  C0402  [C0402]
C119  0.1uF  C0402  [C0402]
C120  0.1uF  C0402  [C0402]
C121  0.1uF  C0402  [C0402]
C122  0.1uF  C0402  [C0402]
C123  4.7uF  C0402  [C0402]
C124  0.1uF  C0402  [C0402]
C125  0.1uF  C0402  [C0402]
C126  0.1uF  C0402  [C0402]
C127  4.7uF  C0402  [C0402]
C128  0.1uF  C0402  [C0402]
C129  4.7uF  C0402  [C0402]
C130  0.1uF  C0402  [C0402]
J2  CON-RJ45-J0011D21BNL  [J0011D21B]
R31  1.5k  R0402  [R0402]
R32  100  R0402  [R0402]
R33  49.9  R0402  [R0402]
R34  49.9  R0402  [R0402]
R35  49.9  R0402  [R0402]
R36  49.9  R0402  [R0402]
R37  22  R0402  [R0402]
R38  22  R0402  [R0402]
R39  22  R0402  [R0402]
R40  22  R0402  [R0402]
R41  2.2k  R0402  [R0402]
R42  100  R0402  [R0402]
R43  22  R0402  [R0402]
R44  22  R0402  [R0402]
R45  22  R0402  [R0402]
R46  2.2k  R0402  [R0402]
R47  2.2k  R0402  [R0402]
R48  2.2k  R0402  [R0402]
R50  2.2k  R0402  [R0402]
R51  2.2k  R0402  [R0402]
R52  2.2k  R0402  [R0402]
R53  4.87k  R0402  [R0402]
U6  DP83848C-VBH48A  [LQFP-48]

### Nets
!MSS_RESET: U6.29(RESET_N) ; also sheet 3
COM+: J2.9(GRN+) R42.1
CRS: R37.2 U6.40(CRS/CRS_DV/LED_CFG)
D3V3: B1.1 C127.1 C128.1 C129.1 C130.1 R31.2 R32.2 R41.2 R42.2 R46.2 R47.2 R48.2 U6.32(IOVDD33) U6.48(IOVDD33) ; also sheet 2,3,5,6,9,10
DGND: C116.2 C118.2 C119.2 C120.2 C121.2 C122.2 C123.2 C124.2 C125.2 C126.2 C127.2 C128.2 C129.2 C130.2 R50.1 R53.1 U6.15(AGND) U6.19(AGND) U6.35(IOGND) U6.36(DGND) U6.47(IOGND) ; also sheet 2,3,5,6,8,10
E3V3: B1.2 C118.1 C119.1 C120.1 C121.1 C122.1 J2.4(TCT) J2.5(RCT) R33.2 R34.2 R35.2 R36.2 R51.2 R52.2 U6.22(AVDD33)
EGND: C116.1 J2.7(NC) J2.8(CHSGND) J2.H$1(CHS) J2.H$2(CHS)
ETH-RBIAS: R53.2 U6.24(RBIAS)
LED_ETH_ACT: J2.11(YEL-) R48.1 U6.26(LED_ACT/COL/AN_EN)
LED_ETH_LINK: J2.10(GRN-) R46.1 U6.28(LED_LINK/AN0)
LED_PHY_SPEED: R47.1 U6.27(LED_SPEED/AN1)
MAC_CRS: R37.1 U1.L3(-ETHERNET-MAC:MAC_CRSDV/IO60RSB4V0)
MAC_EN: R50.2 U6.7(PWR_DOWN/INT) ; also sheet 3,8
MAC_MDC: U1.K2(-ETHERNET-MAC:MAC_MDC/IO57RSB4V0) U6.31(MDC)
MAC_MDIO: R31.1 U1.K1(-ETHERNET-MAC:MAC_MDIO/IO58RSB4V0) U6.30(MDIO)
MAC_RMII_CLK: U1.L5(-ETHERNET-MAC:MAC_CLK) ; also sheet 3
MAC_RXD0: R44.1 U1.M3(-ETHERNET-MAC:MAC_RXD[0]/IO63RSB4V0)
MAC_RXD1: R45.1 U1.N1(-ETHERNET-MAC:MAC_RXD[1]/IO62RSB4V0)
MAC_RXER: R43.1 U1.L4(-ETHERNET-MAC:MAC_RXER/IO59RSB4V0)
MAC_TXD0: R39.1 U1.M1(-ETHERNET-MAC:MAC_TXD[0]/IO65RSB4V0)
MAC_TXD1: R40.1 U1.M2(-ETHERNET-MAC:MAC_TXD[1]/IO64RSB4V0)
MAC_TXEN: R38.1 U1.L2(-ETHERNET-MAC:MAC_TXEN/IO61RSB4V0)
PFBOUT: C123.1 C124.1 C125.1 C126.1 U6.18(PFBIN1) U6.23(PFBOUT) U6.37(PFBIN2)
PHY_RMII_CLK: U6.34(X1) ; also sheet 3
RD+: J2.3(RD+) R34.1 U6.14(RD+)
RD-: J2.6(RD-) R33.1 U6.13(RD-)
RSVD-P20: R51.1 U6.20(RESERVED)
RSVD-P21: R52.1 U6.21(RESERVED)
RX_DV: R41.1 U6.39(RX_DV/MII_MODE)
RX_ER: R43.2 U6.41(RX_ER/MDIX_EN)
RXD_0/PHYAD1: R44.2 U6.43(RXD_0/PHYAD1)
RXD_1/PHYAD2: R45.2 U6.44(RXD_1/PHYAD2)
TD+: J2.1(TD+) R36.1 U6.17(TD+)
TD-: J2.2(TD-) R35.1 U6.16(TD-)
TX_EN: R38.2 U6.2(TX_EN)
TXD_0: R39.2 U6.3(TXD_0)
TXD_1: R40.2 U6.4(TXD_1)
YEL+: J2.12(YEL+) R32.1
Unconnected: U6.1(TX_CLK) U6.5(TXD_2) U6.6(TXD_3/SNI_MODE) U6.8(RESERVED) U6.9(RESERVED) U6.10(RESERVED) U6.11(RESERVED) U6.12(RESERVED) U6.25(25MHZ_OUT) U6.33(X2) U6.38(RX_CLK) U6.42(COL/PHYAD0) U6.45(RXD_2/PHYAD3) U6.46(RXD_3/PHYAD4)

### Notes on the sheet
- Place close to ETH PHY device
- NC
- NC
- NC
- NC
- NC
- AN strap setting: 111
- NC
- NC
- Note: LED_SPEED is not connected
- NC
- NC
- NC
- NC
- NC
- NC
- NC
- ETH
- Ethernet PHY
- TD | RD | TCT | RCT
- PFBOUT | PFBIN1 | PFBIN2 | IOVDD (48) | IOVDD (32)
- AVDD33
- Place close to ETH PHY device | Place close to the transformer center taps

## Sheet 8 of 10
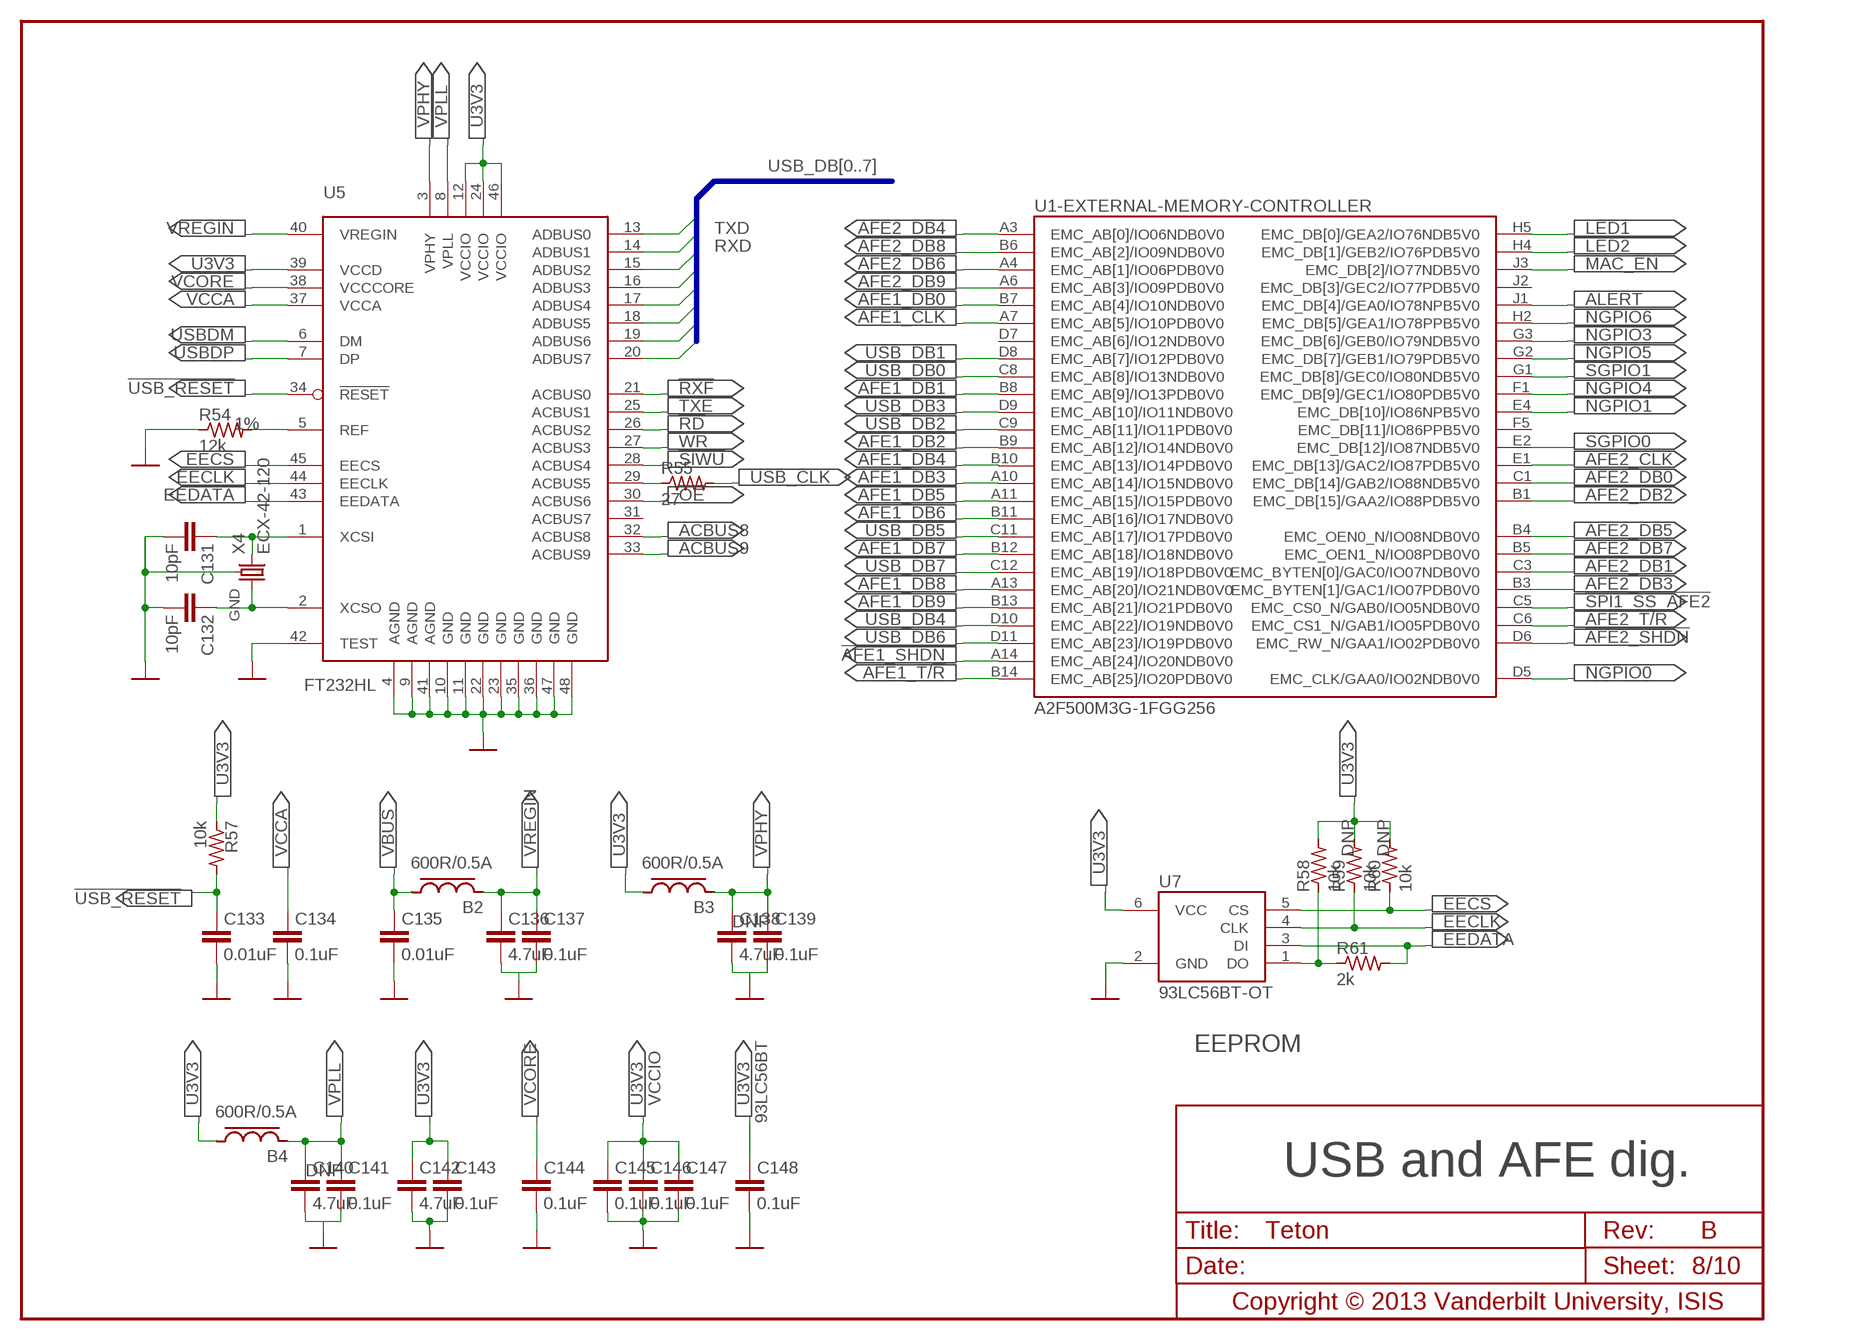
[diagram p7: schematic, sheet 8]

### Parts
B2  600R/0.5A  BEAD-BLM18EG601SN1D0603  [L0603]
B3  600R/0.5A  BEAD-BLM18EG601SN1D0603  [L0603]
B4  600R/0.5A  BEAD-BLM18EG601SN1D0603  [L0603]
C131  10pF  C0402  [C0402]
C132  10pF  C0402  [C0402]
C133  0.01uF  C0402  [C0402]
C134  0.1uF  C0402  [C0402]
C135  0.01uF  C0402  [C0402]
C136  4.7uF  C0402  [C0402]
C137  0.1uF  C0402  [C0402]
C138  4.7uF  C0402  [C0402]
C139  0.1uF  C0402  [C0402]
C140  4.7uF  C0402  [C0402]
C141  0.1uF  C0402  [C0402]
C142  4.7uF  C0402  [C0402]
C143  0.1uF  C0402  [C0402]
C144  0.1uF  C0402  [C0402]
C145  0.1uF  C0402  [C0402]
C146  0.1uF  C0402  [C0402]
C147  0.1uF  C0402  [C0402]
C148  0.1uF  C0402  [C0402]
R54  12k  R0402  [R0402]
R55  27  R0402  [R0402]
R57  10k  R0402  [R0402]
R58  10k  R0402  [R0402]
R59  10k  R0402  [R0402]
R60  10k  R0402  [R0402]
R61  2k  R0402  [R0402]
U5  FT232HL  [LQFP-48]
U7  93LC56BT-OT  [SOT23-6L]
X4  ECX-42-120  [ECX-42]

### Nets
!AFE1_SHDN: U1.A14(-EXTERNAL-MEMORY-CONTROLLER:EMC_AB[24]/IO20NDB0V0) ; also sheet 5
!AFE2_SHDN: U1.D6(-EXTERNAL-MEMORY-CONTROLLER:EMC_RW_N/GAA1/IO02PDB0V0) ; also sheet 6
!OE: U5.30(ACBUS6) ; also sheet 9
!RD: U5.26(ACBUS2) ; also sheet 9
!RXF: U5.21(ACBUS0) ; also sheet 9
!SIWU: U5.28(ACBUS4) ; also sheet 9
!SPI1_SS_AFE2: U1.C5(-EXTERNAL-MEMORY-CONTROLLER:EMC_CS0_N/GAB0/IO05NDB0V0) ; also sheet 6
!TXE: U5.25(ACBUS1) ; also sheet 9
!USB_RESET: C133.1 R57.2 U5.34(!RESET)
!WR: U5.27(ACBUS3) ; also sheet 9
ACBUS8: U5.32(ACBUS8) ; also sheet 9
ACBUS9: U5.33(ACBUS9) ; also sheet 9
AFE1_CLK: U1.A7(-EXTERNAL-MEMORY-CONTROLLER:EMC_AB[5]/IO10PDB0V0) ; also sheet 5
AFE1_DB0: U1.B7(-EXTERNAL-MEMORY-CONTROLLER:EMC_AB[4]/IO10NDB0V0) ; also sheet 5
AFE1_DB1: U1.B8(-EXTERNAL-MEMORY-CONTROLLER:EMC_AB[9]/IO13PDB0V0) ; also sheet 5
AFE1_DB2: U1.B9(-EXTERNAL-MEMORY-CONTROLLER:EMC_AB[12]/IO14NDB0V0) ; also sheet 5
AFE1_DB3: U1.A10(-EXTERNAL-MEMORY-CONTROLLER:EMC_AB[14]/IO15NDB0V0) ; also sheet 5
AFE1_DB4: U1.B10(-EXTERNAL-MEMORY-CONTROLLER:EMC_AB[13]/IO14PDB0V0) ; also sheet 5
AFE1_DB5: U1.A11(-EXTERNAL-MEMORY-CONTROLLER:EMC_AB[15]/IO15PDB0V0) ; also sheet 5
AFE1_DB6: U1.B11(-EXTERNAL-MEMORY-CONTROLLER:EMC_AB[16]/IO17NDB0V0) ; also sheet 5
AFE1_DB7: U1.B12(-EXTERNAL-MEMORY-CONTROLLER:EMC_AB[18]/IO18NDB0V0) ; also sheet 5
AFE1_DB8: U1.A13(-EXTERNAL-MEMORY-CONTROLLER:EMC_AB[20]/IO21NDB0V0) ; also sheet 5
AFE1_DB9: U1.B13(-EXTERNAL-MEMORY-CONTROLLER:EMC_AB[21]/IO21PDB0V0) ; also sheet 5
AFE1_T/!R: U1.B14(-EXTERNAL-MEMORY-CONTROLLER:EMC_AB[25]/IO20PDB0V0) ; also sheet 5
AFE2_CLK: U1.E1(-EXTERNAL-MEMORY-CONTROLLER:EMC_DB[13]/GAC2/IO87PDB5V0) ; also sheet 6
AFE2_DB0: U1.C1(-EXTERNAL-MEMORY-CONTROLLER:EMC_DB[14]/GAB2/IO88NDB5V0) ; also sheet 6
AFE2_DB1: U1.C3(-EXTERNAL-MEMORY-CONTROLLER:EMC_BYTEN[0]/GAC0/IO07NDB0V0) ; also sheet 6
AFE2_DB2: U1.B1(-EXTERNAL-MEMORY-CONTROLLER:EMC_DB[15]/GAA2/IO88PDB5V0) ; also sheet 6
AFE2_DB3: U1.B3(-EXTERNAL-MEMORY-CONTROLLER:EMC_BYTEN[1]/GAC1/IO07PDB0V0) ; also sheet 6
AFE2_DB4: U1.A3(-EXTERNAL-MEMORY-CONTROLLER:EMC_AB[0]/IO06NDB0V0) ; also sheet 6
AFE2_DB5: U1.B4(-EXTERNAL-MEMORY-CONTROLLER:EMC_OEN0_N/IO08NDB0V0) ; also sheet 6
AFE2_DB6: U1.A4(-EXTERNAL-MEMORY-CONTROLLER:EMC_AB[1]/IO06PDB0V0) ; also sheet 6
AFE2_DB7: U1.B5(-EXTERNAL-MEMORY-CONTROLLER:EMC_OEN1_N/IO08PDB0V0) ; also sheet 6
AFE2_DB8: U1.B6(-EXTERNAL-MEMORY-CONTROLLER:EMC_AB[2]/IO09NDB0V0) ; also sheet 6
AFE2_DB9: U1.A6(-EXTERNAL-MEMORY-CONTROLLER:EMC_AB[3]/IO09PDB0V0) ; also sheet 6
AFE2_T/!R: U1.C6(-EXTERNAL-MEMORY-CONTROLLER:EMC_CS1_N/GAB1/IO05PDB0V0) ; also sheet 6
ALERT: U1.J1(-EXTERNAL-MEMORY-CONTROLLER:EMC_DB[4]/GEA0/IO78NPB5V0) ; also sheet 10
DGND: C131.2 C132.2 C133.2 C134.2 C135.2 C136.2 C137.2 C138.2 C139.2 C140.2 C141.2 C142.2 C143.2 C144.2 C145.2 C146.2 C147.2 C148.2 R54.1 U5.4(AGND) U5.9(AGND) U5.10(GND) U5.11(GND) U5.22(GND) U5.23(GND) U5.35(GND) U5.36(GND) U5.41(AGND) U5.42(TEST) U5.47(GND) U5.48(GND) U7.2(GND) X4.2(GND) X4.4(GND) ; also sheet 2,3,5,6,7,10
EECLK: R59.1 U5.44(EECLK) U7.4(CLK)
EECS: R60.1 U5.45(EECS) U7.5(CS)
EEDATA: R61.2 U5.43(EEDATA) U7.3(DI)
EEDO: R58.1 R61.1 U7.1(DO)
LED1: U1.H5(-EXTERNAL-MEMORY-CONTROLLER:EMC_DB[0]/GEA2/IO76NDB5V0) ; also sheet 9
LED2: U1.H4(-EXTERNAL-MEMORY-CONTROLLER:EMC_DB[1]/GEB2/IO76PDB5V0) ; also sheet 9
MAC_EN: U1.J3(-EXTERNAL-MEMORY-CONTROLLER:EMC_DB[2]/IO77NDB5V0) ; also sheet 3,7
NGPIO0: U1.D5(-EXTERNAL-MEMORY-CONTROLLER:EMC_CLK/GAA0/IO02NDB0V0) ; also sheet 10
NGPIO1: U1.E4(-EXTERNAL-MEMORY-CONTROLLER:EMC_DB[10]/IO86NPB5V0) ; also sheet 10
NGPIO3: U1.G3(-EXTERNAL-MEMORY-CONTROLLER:EMC_DB[6]/GEB0/IO79NDB5V0) ; also sheet 10
NGPIO4: U1.F1(-EXTERNAL-MEMORY-CONTROLLER:EMC_DB[9]/GEC1/IO80PDB5V0) ; also sheet 10
NGPIO5: U1.G2(-EXTERNAL-MEMORY-CONTROLLER:EMC_DB[7]/GEB1/IO79PDB5V0) ; also sheet 10
NGPIO6: U1.H2(-EXTERNAL-MEMORY-CONTROLLER:EMC_DB[5]/GEA1/IO78PPB5V0) ; also sheet 10
SGPIO0: U1.E2(-EXTERNAL-MEMORY-CONTROLLER:EMC_DB[12]/IO87NDB5V0) ; also sheet 10
SGPIO1: U1.G1(-EXTERNAL-MEMORY-CONTROLLER:EMC_DB[8]/GEC0/IO80NDB5V0) ; also sheet 10
U3V3: B3.1 B4.1 C142.1 C143.1 C145.1 C146.1 C147.1 C148.1 R57.1 R58.2 R59.2 R60.2 U5.12(VCCIO) U5.24(VCCIO) U5.39(VCCD) U5.46(VCCIO) U7.6(VCC)
UREF: R54.2 U5.5(REF)
USB_CLK: R55.2 ; also sheet 9
USB_CLKF: R55.1 U5.29(ACBUS5)
USB_DB0: U1.C8(-EXTERNAL-MEMORY-CONTROLLER:EMC_AB[8]/IO13NDB0V0) U5.13(ADBUS0) ; also sheet 9
USB_DB1: U1.D8(-EXTERNAL-MEMORY-CONTROLLER:EMC_AB[7]/IO12PDB0V0) U5.14(ADBUS1) ; also sheet 9
USB_DB2: U1.C9(-EXTERNAL-MEMORY-CONTROLLER:EMC_AB[11]/IO11PDB0V0) U5.15(ADBUS2)
USB_DB3: U1.D9(-EXTERNAL-MEMORY-CONTROLLER:EMC_AB[10]/IO11NDB0V0) U5.16(ADBUS3)
USB_DB4: U1.D10(-EXTERNAL-MEMORY-CONTROLLER:EMC_AB[22]/IO19NDB0V0) U5.17(ADBUS4)
USB_DB5: U1.C11(-EXTERNAL-MEMORY-CONTROLLER:EMC_AB[17]/IO17PDB0V0) U5.18(ADBUS5)
USB_DB6: U1.D11(-EXTERNAL-MEMORY-CONTROLLER:EMC_AB[23]/IO19PDB0V0) U5.19(ADBUS6)
USB_DB7: U1.C12(-EXTERNAL-MEMORY-CONTROLLER:EMC_AB[19]/IO18PDB0V0) U5.20(ADBUS7)
USBDM: U5.6(DM) ; also sheet 10
USBDP: U5.7(DP) ; also sheet 10
UXCSI: C131.1 U5.1(XCSI) X4.3
UXCSO: C132.1 U5.2(XCSO) X4.1
VBUS: B2.1 C135.1 ; also sheet 10
VCCA: C134.1 U5.37(VCCA)
VCORE: C144.1 U5.38(VCCCORE)
VPHY: B3.2 C138.1 C139.1 U5.3(VPHY)
VPLL: B4.2 C140.1 C141.1 U5.8(VPLL)
VREGIN: B2.2 C136.1 C137.1 U5.40(VREGIN)
Unconnected: U1.D7(-EXTERNAL-MEMORY-CONTROLLER:EMC_AB[6]/IO12NDB0V0) U1.F5(-EXTERNAL-MEMORY-CONTROLLER:EMC_DB[11]/IO86PPB5V0) U1.J2(-EXTERNAL-MEMORY-CONTROLLER:EMC_DB[3]/GEC2/IO77PDB5V0) U5.31(ACBUS7)

### Buses
USB_DB[0..7]

### Notes on the sheet
- TXD
- RXD
- USB
- EEPROM
- VCCIO
- 93LC56BT

## Sheet 9 of 10
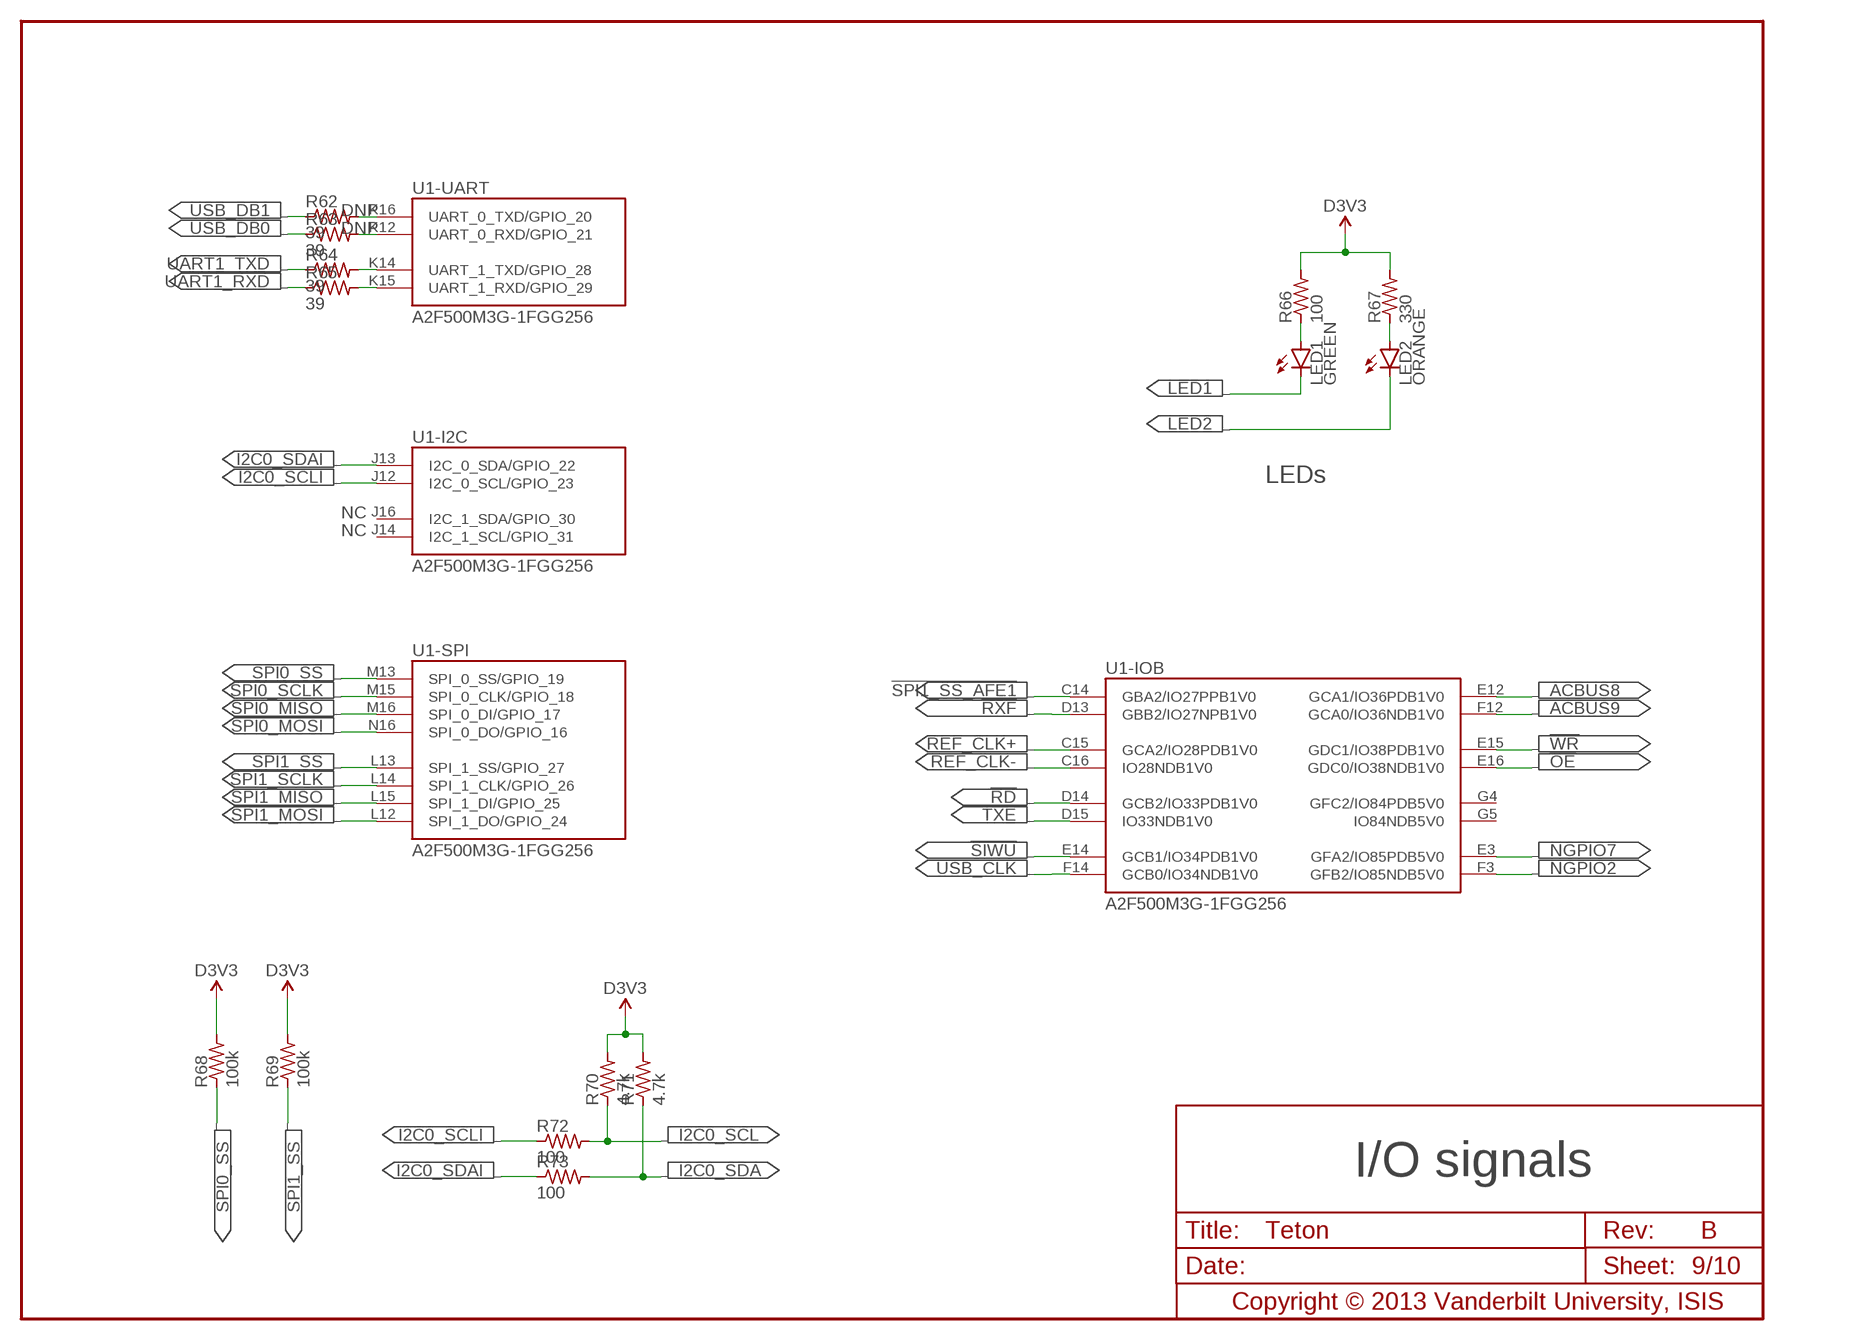
[diagram p8: schematic, sheet 9]

### Parts
LED1  LED-MGC-3010  [LED1208-RA]
LED2  LED-ECK-3010  [LED1208-RA]
R62  39  R0402  [R0402]
R63  39  R0402  [R0402]
R64  39  R0402  [R0402]
R65  39  R0402  [R0402]
R66  100  R0402  [R0402]
R67  330  R0402  [R0402]
R68  100k  R0402  [R0402]
R69  100k  R0402  [R0402]
R70  4.7k  R0402  [R0402]
R71  4.7k  R0402  [R0402]
R72  100  R0402  [R0402]
R73  100  R0402  [R0402]

### Nets
!OE: U1.E16(-IOB:GDC0/IO38NDB1V0) ; also sheet 8
!RD: U1.D14(-IOB:GCB2/IO33PDB1V0) ; also sheet 8
!RXF: U1.D13(-IOB:GBB2/IO27NPB1V0) ; also sheet 8
!SIWU: U1.E14(-IOB:GCB1/IO34PDB1V0) ; also sheet 8
!SPI1_SS_AFE1: U1.C14(-IOB:GBA2/IO27PPB1V0) ; also sheet 5
!TXE: U1.D15(-IOB:IO33NDB1V0) ; also sheet 8
!WR: U1.E15(-IOB:GDC1/IO38PDB1V0) ; also sheet 8
ACBUS8: U1.E12(-IOB:GCA1/IO36PDB1V0) ; also sheet 8
ACBUS9: U1.F12(-IOB:GCA0/IO36NDB1V0) ; also sheet 8
D3V3: R66.2 R67.2 R68.2 R69.2 R70.2 R71.2 ; also sheet 2,3,5,6,7,10
I2C0_SCL: R70.1 R72.2 ; also sheet 10
I2C0_SCLI: R72.1 U1.J12(-I2C:I2C_0_SCL/GPIO_23)
I2C0_SDA: R71.1 R73.2 ; also sheet 10
I2C0_SDAI: R73.1 U1.J13(-I2C:I2C_0_SDA/GPIO_22)
LED1: LED1.1(C) ; also sheet 8
LED1H: LED1.2(A) R66.1
LED2: LED2.1(C) ; also sheet 8
LED2H: LED2.2(A) R67.1
NGPIO2: U1.F3(-IOB:GFB2/IO85NDB5V0) ; also sheet 10
NGPIO7: U1.E3(-IOB:GFA2/IO85PDB5V0) ; also sheet 10
REF_CLK+: U1.C15(-IOB:GCA2/IO28PDB1V0) ; also sheet 10
REF_CLK-: U1.C16(-IOB:IO28NDB1V0) ; also sheet 10
SPI0_MISO: U1.M16(-SPI:SPI_0_DI/GPIO_17) ; also sheet 10
SPI0_MOSI: U1.N16(-SPI:SPI_0_DO/GPIO_16) ; also sheet 10
SPI0_SCLK: U1.M15(-SPI:SPI_0_CLK/GPIO_18) ; also sheet 10
SPI0_SS: R68.1 U1.M13(-SPI:SPI_0_SS/GPIO_19) ; also sheet 10
SPI1_MISO: U1.L15(-SPI:SPI_1_DI/GPIO_25) ; also sheet 5,6,10
SPI1_MOSI: U1.L12(-SPI:SPI_1_DO/GPIO_24) ; also sheet 5,6,10
SPI1_SCLK: U1.L14(-SPI:SPI_1_CLK/GPIO_26) ; also sheet 5,6,10
SPI1_SS: R69.1 U1.L13(-SPI:SPI_1_SS/GPIO_27) ; also sheet 10
UART0_RXD: R63.2 U1.K12(-UART:UART_0_RXD/GPIO_21)
UART0_TXD: R62.2 U1.K16(-UART:UART_0_TXD/GPIO_20)
UART1_RXD: R65.1 ; also sheet 10
UART1_RXDI: R65.2 U1.K15(-UART:UART_1_RXD/GPIO_29)
UART1_TXD: R64.1 ; also sheet 10
UART1_TXDI: R64.2 U1.K14(-UART:UART_1_TXD/GPIO_28)
USB_CLK: U1.F14(-IOB:GCB0/IO34NDB1V0) ; also sheet 8
USB_DB0: R63.1 ; also sheet 8
USB_DB1: R62.1 ; also sheet 8
Unconnected: U1.G4(-IOB:GFC2/IO84PDB5V0) U1.G5(-IOB:IO84NDB5V0) U1.J14(-I2C:I2C_1_SCL/GPIO_31) U1.J16(-I2C:I2C_1_SDA/GPIO_30)

### Notes on the sheet
- GREEN | ORANGE
- LEDs
- NC
- NC
- I/O

## Sheet 10 of 10
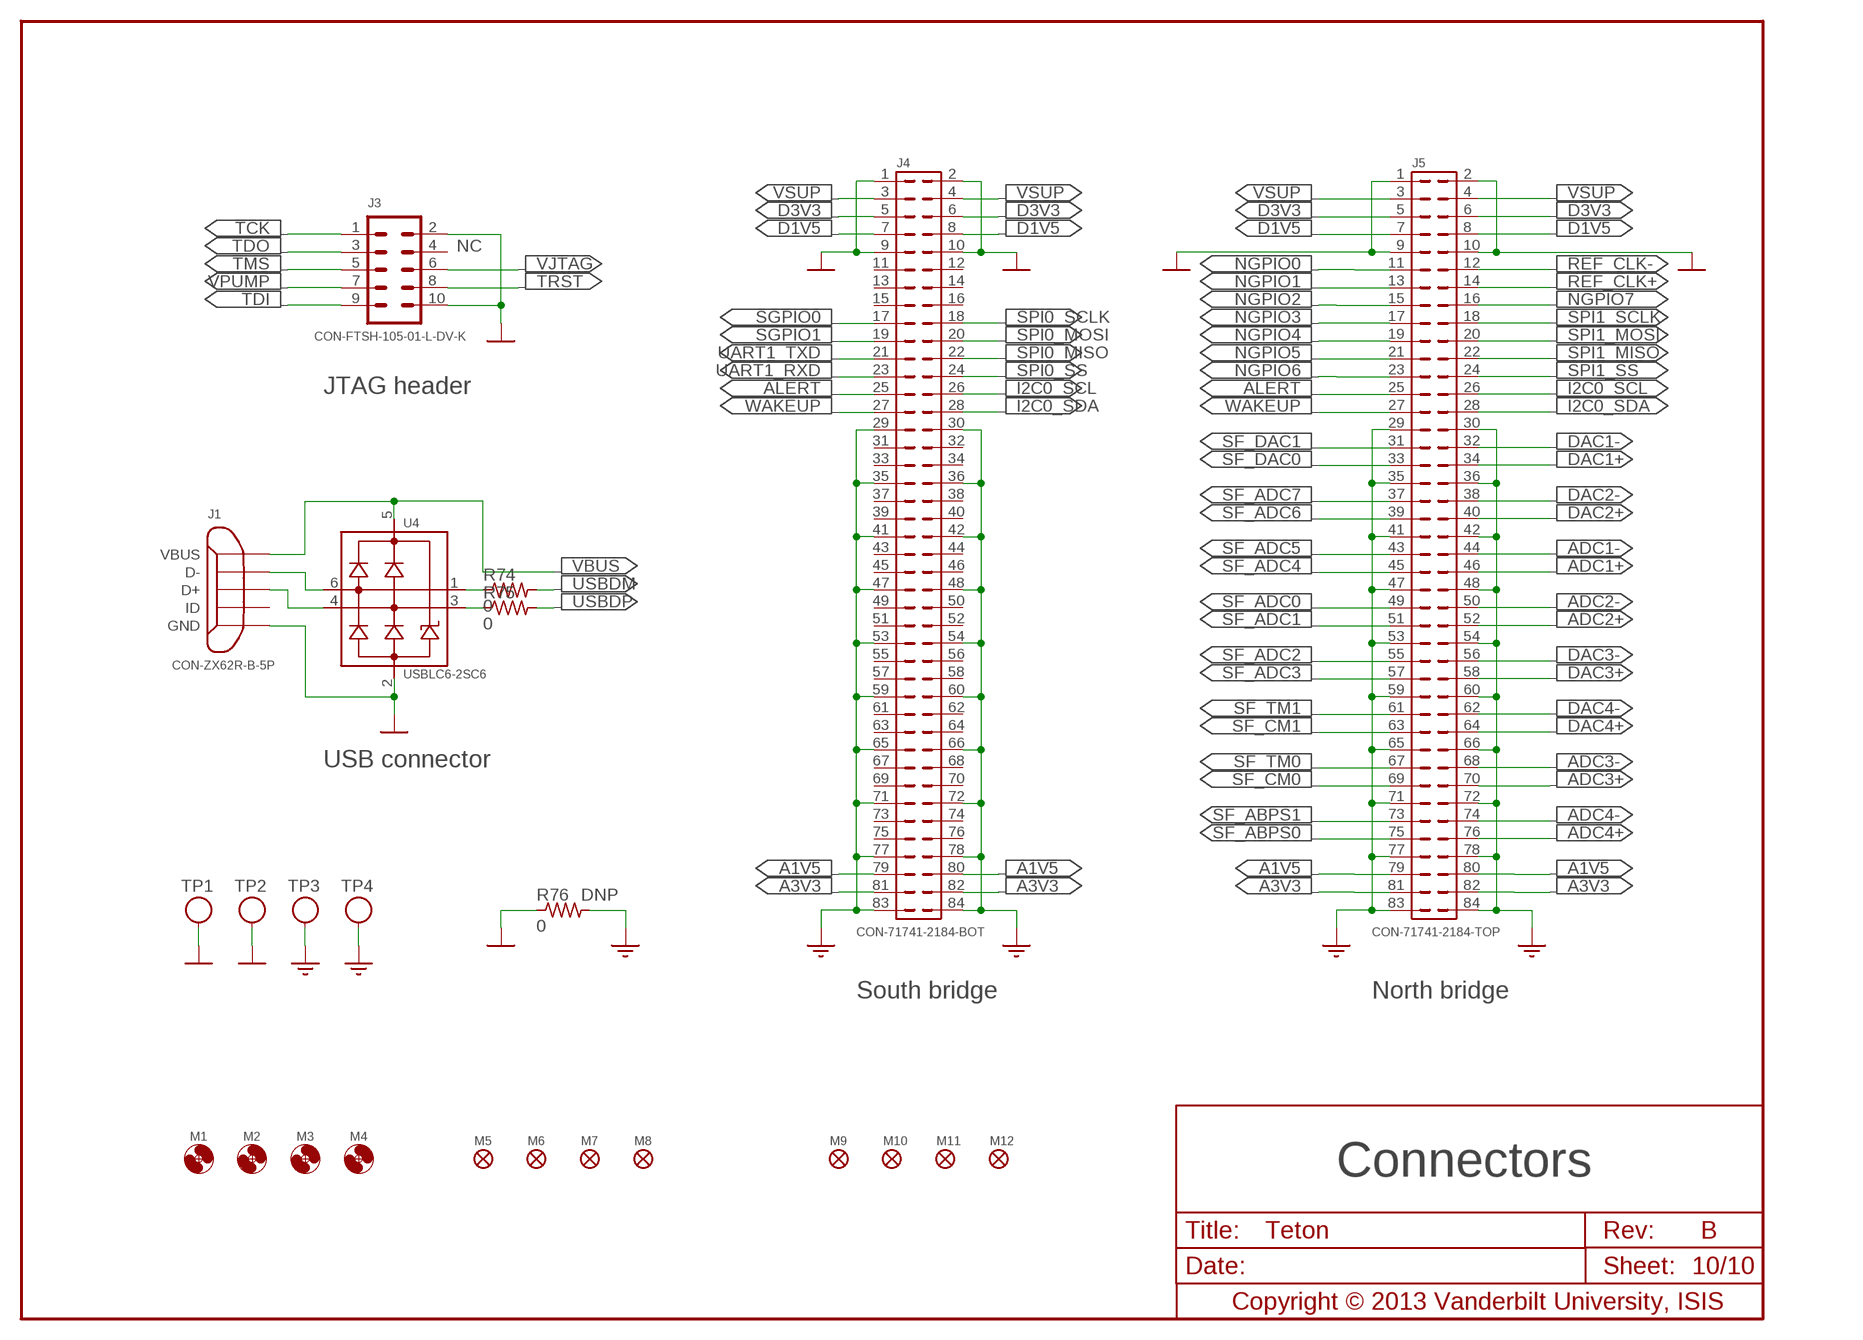
[diagram p9: schematic, sheet 10]

### Parts
J1  CON-ZX62R-B-5P  [ZX62R-B-5P]
J3  CON-FTSH-105-01-L-DV-K  [FTSH-105-01-L-DV-K]
J4  CON-71741-2184-BOT  [71742-3003-BOT]
J5  CON-71741-2184-TOP  [71741-0002]
M1  MOUNT-HOLE3.3  [3,3]
M2  MOUNT-HOLE3.3  [3,3]
M3  MOUNT-HOLE3.3  [3,3]
M4  MOUNT-HOLE3.3  [3,3]
M5  FIDUCIAL1X2  [FIDUCIAL-1X2]
M6  FIDUCIAL1X2  [FIDUCIAL-1X2]
M7  FIDUCIAL1X2  [FIDUCIAL-1X2]
M8  FIDUCIAL1X2  [FIDUCIAL-1X2]
M9  FIDUCIAL1X2  [FIDUCIAL-1X2]
M10  FIDUCIAL1X2  [FIDUCIAL-1X2]
M11  FIDUCIAL1X2  [FIDUCIAL-1X2]
M12  FIDUCIAL1X2  [FIDUCIAL-1X2]
R74  0  R0402  [R0402]
R75  0  R0402  [R0402]
R76  0  R0603  [R0603]
TP1  TESTPOINT-YELLOW  [TESTPOINT]
TP2  TESTPOINT-YELLOW  [TESTPOINT]
TP3  TESTPOINT-GREEN  [TESTPOINT]
TP4  TESTPOINT-GREEN  [TESTPOINT]
U4  USBLC6-2SC6  [SOT23-6L]

### Nets
!WAKEUP: J4.27 J5.27 ; also sheet 3
A1V5: J4.79 J4.80 J5.79 J5.80 ; also sheet 2
A3V3: J4.81 J4.82 J5.81 J5.82 ; also sheet 2,4,5,6
ADC1+: J5.46 ; also sheet 5
ADC1-: J5.44 ; also sheet 5
ADC2+: J5.52 ; also sheet 5
ADC2-: J5.50 ; also sheet 5
ADC3+: J5.70 ; also sheet 6
ADC3-: J5.68 ; also sheet 6
ADC4+: J5.76 ; also sheet 6
ADC4-: J5.74 ; also sheet 6
AGND: J4.29 J4.30 J4.35 J4.36 J4.41 J4.42 J4.47 J4.48 J4.53 J4.54 J4.59 J4.60 J4.65 J4.66 J4.71 J4.72 J4.77 J4.78 J4.83 J4.84 J5.29 J5.30 J5.35 J5.36 J5.41 J5.42 J5.47 J5.48 J5.53 J5.54 J5.59 J5.60 J5.65 J5.66 J5.71 J5.72 J5.77 J5.78 J5.83 J5.84 R76.2 TP3.1 TP4.1 ; also sheet 2,3,4,5,6
ALERT: J4.25 J5.25 ; also sheet 8
D1V5: J4.7 J4.8 J5.7 J5.8 ; also sheet 2
D3V3: J4.5 J4.6 J5.5 J5.6 ; also sheet 2,3,5,6,7,9
DAC1+: J5.34 ; also sheet 5
DAC1-: J5.32 ; also sheet 5
DAC2+: J5.40 ; also sheet 5
DAC2-: J5.38 ; also sheet 5
DAC3+: J5.58 ; also sheet 6
DAC3-: J5.56 ; also sheet 6
DAC4+: J5.64 ; also sheet 6
DAC4-: J5.62 ; also sheet 6
DGND: J1.5(GND) J3.2 J3.10 J4.1 J4.2 J4.9 J4.10 J5.1 J5.2 J5.9 J5.10 R76.1 TP1.1 TP2.1 U4.2(GND) ; also sheet 2,3,5,6,7,8
I2C0_SCL: J4.26 J5.26 ; also sheet 9
I2C0_SDA: J4.28 J5.28 ; also sheet 9
NGPIO0: J5.11 ; also sheet 8
NGPIO1: J5.13 ; also sheet 8
NGPIO2: J5.15 ; also sheet 9
NGPIO3: J5.17 ; also sheet 8
NGPIO4: J5.19 ; also sheet 8
NGPIO5: J5.21 ; also sheet 8
NGPIO6: J5.23 ; also sheet 8
NGPIO7: J5.16 ; also sheet 9
REF_CLK+: J5.14 ; also sheet 9
REF_CLK-: J5.12 ; also sheet 9
SF_ABPS0: J5.75 ; also sheet 4
SF_ABPS1: J5.73 ; also sheet 4
SF_ADC0: J5.49 ; also sheet 4
SF_ADC1: J5.51 ; also sheet 4
SF_ADC2: J5.55 ; also sheet 4
SF_ADC3: J5.57 ; also sheet 4
SF_ADC4: J5.45 ; also sheet 4
SF_ADC5: J5.43 ; also sheet 4
SF_ADC6: J5.39 ; also sheet 4
SF_ADC7: J5.37 ; also sheet 4
SF_CM0: J5.69 ; also sheet 4
SF_CM1: J5.63 ; also sheet 4
SF_DAC0: J5.33 ; also sheet 4
SF_DAC1: J5.31 ; also sheet 4
SF_TM0: J5.67 ; also sheet 4
SF_TM1: J5.61 ; also sheet 4
SGPIO0: J4.17 ; also sheet 8
SGPIO1: J4.19 ; also sheet 8
SPI0_MISO: J4.22 ; also sheet 9
SPI0_MOSI: J4.20 ; also sheet 9
SPI0_SCLK: J4.18 ; also sheet 9
SPI0_SS: J4.24 ; also sheet 9
SPI1_MISO: J5.22 ; also sheet 5,6,9
SPI1_MOSI: J5.20 ; also sheet 5,6,9
SPI1_SCLK: J5.18 ; also sheet 5,6,9
SPI1_SS: J5.24 ; also sheet 9
TCK: J3.1 ; also sheet 3
TDI: J3.9 ; also sheet 3
TDO: J3.3 ; also sheet 3
TMS: J3.5 ; also sheet 3
TRST: J3.8 ; also sheet 3
UART1_RXD: J4.23 ; also sheet 9
UART1_TXD: J4.21 ; also sheet 9
USBDM: R74.2 ; also sheet 8
USBDM-IN: J1.2(D-) U4.6(IO1)
USBDM-OUT: R74.1 U4.1(IO1)
USBDP: R75.2 ; also sheet 8
USBDP-IN: J1.3(D+) U4.4(IO2)
USBDP-OUT: R75.1 U4.3(IO2)
VBUS: J1.1(VBUS) U4.5(VBUS) ; also sheet 8
VJTAG: J3.6 ; also sheet 3
VPUMP: J3.7 ; also sheet 3
VSUP: J4.3 J4.4 J5.3 J5.4
Unconnected: J1.4(ID) J1.MNT$1(MNT) J1.MNT$2(MNT) J1.MNT$3(MNT) J1.MNT$4(MNT) J1.MNT$5(MNT) J1.MNT$6(MNT) J3.4 J4.11 J4.12 J4.13 J4.14 J4.15 J4.16 J4.31 J4.32 J4.33 J4.34 J4.37 J4.38 J4.39 J4.40 J4.43 J4.44 J4.45 J4.46 J4.49 J4.50 J4.51 J4.52 J4.55 J4.56 J4.57 J4.58 J4.61 J4.62 J4.63 J4.64 J4.67 J4.68 J4.69 J4.70 J4.73 J4.74 J4.75 J4.76

### Notes on the sheet
- NC
- JTAG header
- USB connector
- CON
- South bridge | North bridge

## Library data of the parts
B1 = MainBoard:BEAD: BEAD; CURRENT-RATING: 4 A; DIGI-KEY#: 490-5224-1-ND; IMPEDANCE: 70 Ohm @ 100 MHz; MF: Murata; MPN: BLM18SG700TN1D
B2-B4 = MainBoard:BEAD: BEAD; CURRENT-RATING: 0.5 A; DIGI-KEY#: 490-3994-2-ND; IMPEDANCE: 600 Ohm @ 100 MHz; MF: Murata; MPN: BLM18EG601SN1D
C1-C36 C38-C44 C49-C51 C56 C59 C61 C64 C66-C86 C89 C91 C94 C96-C115 C118-C137 C139 C141-C148 = MainBoard:C: CAPACITOR
C37 C47 C48 C52-C55 C138 C140 = MainBoard:C: CAPACITOR; DNP: ON
C45 = MainBoard:C: CAPACITOR; VOTLAGE-RATING: 16V
C46 = MainBoard:C: CAPACITOR; VOLTAGE-RATING: 16V
C57 C58 C60 C62 C63 C65 C87 C88 C90 C92 C93 C95 = MainBoard:C: CAPACITOR; DNP: on
C116 = MainBoard:C: CAPACITOR; RATING: 250V
J1 = MainBoard:CON-ZX62R-B-5P: ZX62R-B-5P Hirose ZX Series Micro-B USB receptacle (right angle, top mount, SMT) Source: http://www.hirose.co.jp/cataloge_hp/e24200011.pdf http://media.digikey.com/PDF/Data%20Sheets/Hirose%20PDFs/ZX62R-B-5P.pdf; DIGI-KEY#: H11574CT-ND; MF: Hirose; MPN: ZX62R-B-5P; TEMINATION-TYPE: Right-angle SMT, Horizontal
J2 = MainBoard:CON-RJ45-J0011D21B: RJ45 J0011D21B PulseJack RJ-45 connector with 13.8mm height profile. Source: http://ww2.pulseeng.com/products/datasheets/J403.pdf
J3 = MainBoard:CON-FTSH-105-01-L-DV-K: FTSH Header Samtec FTSH series 2 x 5 pin SMT micro header Source: http://www.samtec.com/ftppub/pdf/ftsh_mt.pdf; DIGI-KEY#: FTSH-105-01-L-DV-K-ND; MF: Samtec; MPN: FTSH-105-01-L-DV-K
J4 = MainBoard:CON-71741: 84-pin Board-to-Board Connector 1.00mm (.039") Pitch Mezzanine Plug, Surface Mount, Dual Row, Vertical Stacking, 84 Circuits, 8.35mm (.329") Unmated Height, with PCB Locator Pegs, with Robotic Placement Metal Cap, 0.25µm (10µ") Gold (Au) Selective Plating, Embossed Tape on R Source: http://www.molex.com/molex/products/datasheet.jsp?part=active/0717410002_PCB_HEADERS.xml; DIGI-KEY#: WM3499CT-ND; MF: Molex; MPN: 71742-3003
J5 = MainBoard:CON-71741: 84-pin Board-to-Board Connector 1.00mm (.039") Pitch Mezzanine Plug, Surface Mount, Dual Row, Vertical Stacking, 84 Circuits, 8.35mm (.329") Unmated Height, with PCB Locator Pegs, with Robotic Placement Metal Cap, 0.25µm (10µ") Gold (Au) Selective Plating, Embossed Tape on R Source: http://www.molex.com/molex/products/datasheet.jsp?part=active/0717410002_PCB_HEADERS.xml; DIGI-KEY#: WM3498CT-ND; MF: Molex; MPN: 71741-0002
L1 L2 = MainBoard:L: INDUCTOR
LED1 = MainBoard:LED: LED; COLOR: Green; IV: 80mcd@20mA; MF: Kingbright; MPN: APECVA3010MGC; VF: 2.1V
LED2 = MainBoard:LED: LED; COLOR: Orange; IV: 250mcd@20mA; MF: Kingbright; MPN: APECVA3010SECK; VF: 2.1V
LOGO1 = Logo:LOGO-VANDERBILT-600MIL: Vanderbilt Logo Official Framed Vanderbilt Logo Generated from 360 x 360 px bitmap and scaled to 600 x 600 mil v1.1 Source bitmap smoothened v1.0 Initial design
LOGO2 = Logo:LOGO-ISIS-600MIL: ISIS Logo Official logo of the Institute for Software Integrated Systems (ISIS), Vanderbilt as of 2011 Generated from 360 x 360 px bitmap and scaled to 600 x 600 mil v1.0 Initial design
LOGO3 = Logo:LOGO-MARMOTE-600MIL: Marmote Platform Logo Preliminary logo for the Marmote Platform (http://marmote.googlecode.com) Generated from 360 x 360 px bitmap and scaled to 600 x 600 mil v1.1 Source bitmap smoothened v1.0 Initial design
LOGO4 = Logo:LOGO-SMARTFUSION-600MIL: SmartFusion Logo Preliminary logo for the Marmote platform SmartFusion-based main board module Generated from 360 x 360 px bitmap and scaled to 600 x 600 mil v1.0 Initial design
M1-M4 = MainBoard:MOUNT-HOLE: MOUNTING HOLE with drill center marker
M5-M12 = MainBoard:FIDUCIAL: Fiducial Alignment Points Various fiducial points for machine vision alignment.
Q1 = MainBoard:MMBT3904: NPN Transistor; DIGI-KEY#: MMBT3904FSCT-ND; MF: Fairchild Semiconductor; MPN: MMBT3904
R1-R13 R19-R48 R50-R52 R55 R57 R58 R61 R64-R75 = MainBoard:R: RESISTOR
R14-R18 R59 R60 = MainBoard:R: RESISTOR; DNP: ON
R53 R54 = MainBoard:R: RESISTOR; TOLERANCE: 1%
R62 R63 R76 = MainBoard:R: RESISTOR; DNP: on
SW1 SW2 = MainBoard:SWITCH-ESWITCH-TL3340: E-Switch TL3340 series momentary switch Source: http://www.e-switch.com/Portals/0/Series_Pdf/TL3340.pdf; DIGI-KEY#: EG4627CT-ND; MF: E-Switch; MPN: TL3340AF160QG
SW3 = MainBoard:SWITCH-CJS-1200: CJS-1200 SPDT Switch Source: http://media.digikey.com/pdf/Data%20Sheets/COPAL%20Electronics%20PDFs/CJS.pdf; DIGI-KEY#: 563-1021-1-ND; MF: CJS; MPN: CJS-1200TA
TP1 TP2 = MainBoard:TESTPOINT: Test Point Keystone compact through hole mount test point for SUPPLY and GROUND signals Terminal: .015 (.38) × .032 (.81) thick Phosphor Bronze Wire, Silver Plate Base: Nylon 46, UL Rated 94V-0 Mtg. Hole: .063 (1.6) Diameter Source: http://www.keyelco.com/pdfs/M55p51.pdf; DIGI-KEY#: 5009K-ND; MF: Keystone; MPN: 5009
TP3 TP4 = MainBoard:TESTPOINT: Test Point Keystone compact through hole mount test point for SUPPLY and GROUND signals Terminal: .015 (.38) × .032 (.81) thick Phosphor Bronze Wire, Silver Plate Base: Nylon 46, UL Rated 94V-0 Mtg. Hole: .063 (1.6) Diameter Source: http://www.keyelco.com/pdfs/M55p51.pdf; DIGI-KEY#: 5121K-ND; MF: Keystone; MPN: 5121
U1 = MainBoard:A2F500M3G: A2F500M3G FG256 SmartFusion A2F500M3G device in FG256 package with organized block symbols Sources: A2F500M3-FG256 BSDL <http://www.actel.com/documents/bsdl/A2F200M3F_FG256.bsd> Package Mechanical Drawings <http://www.actel.com/documents/PckgMechDrwngs.pdf> SmartFusion Intelligent Mixed Signal FPGAs Datasheet <http://www.actel.com/documents/SmartFusion_DS.pdf>; DIGI-KEY#: 1100-1007-ND; MF: Microsemi; MPN: A2F500M3G-1FGG256; SPEED: 100 MHz
U2 U3 = MainBoard:MAX19706: Maxim MAX19706 Low-Power Analog Front-End Low-power analog front-end featuring: Dual 10-bit 22 MSPS Rx ADC Dual 10-bit 22 MSPS Tx DAC Source: http://datasheets.maxim-ic.com/en/ds/MAX19706.pdf; DIGI-KEY#: MAX19706ETM+-ND; MF: Maxim; MPN: MAX19706ETM+
U4 = MainBoard:USBLC6-2: USBLC6-2 Very low capacitance ESD protection Source: http://www.st.com/internet/com/TECHNICAL_RESOURCES/TECHNICAL_LITERATURE/DATASHEET/CD00050750.pdf; DIGI-KEY#: 497-5235-1-ND; MF: STMicroelectronics; MPN: USBLC6-2SC6
U5 = MainBoard:FT232H: FTDI FT232H Single channel hi-speed USB to multi-purpose UART/FIFO IC Source: http://www.ftdichip.com/Support/Documents/DataSheets/ICs/DS_FT232H.pdf; DIGI-KEY#: 768-1101-1-ND; MF: FTDI; MOUSER#: 895-FT232HL-REEL; MPN: 768-1101-1-ND
U6 = MainBoard:DP83848C: National Semiconductor DP83848C PHYTER Single Port 10/100 Mb/s Ethernet Physical Layer Transceiver. Source: http://cache.national.com/ds/DP/DP83848C.pdf; DIGI-KEY#: DP83848CVV-ND; MF: National Semiconductor; MPN: DP83848C
U7 = MainBoard:93LC56BT: 93LC56BT Microchip 2K Microwire Compatible Serial EEPROM Source: http://ww1.microchip.com/downloads/en/DeviceDoc/21794F.pdf; DIGI-KEY#: 93LC56BT-I/OTCT-ND; MF: Microchip Technology; MPN: 93LC56BT-I/OT
U8 = MainBoard:DS1818: DS1818 Reset IC Dallas 3.3V EconoReset with Pushbutton Source: http://datasheets.maxim-ic.com/en/ds/DS1818.pdf; DIGI-KEY#: DS1818R-10+CT-ND; MF: Maxim; MPN: DS1818R-10+T&R; TRIP-POINT: 2.88 V
X1 = MainBoard:ECX-2236: ECX-2236 Compact SMD crystal in 2.5 x 2.0 x 0.55 mm ceramic package. Source: http://www.ecsxtal.com/store/pdf/ECX-2236.pdf Note: Device has two GND pins named DGND; CLOAD: 8pF; DIGI-KEY#: XC1556CT-ND; FREQ: 20 MHz; FREQ-STAB: 10 ppm; FREQ-TOLERANCE: 10 ppm; MF: ECS; MPN: ECS-200-8-36CKM
X2 = MainBoard:ECX-31B: ECX-31B ECS Inc. ultra-miniature compact SMD tuning fork crystal in 3.2 x 1.5 x 0.9 mm ceramic package. Source: http://www.ecsxtal.com/store/pdf/ecx-31b.pdf; CLOAD: 7pF; DIGI-KEY#: XC1656CT-ND; FREQ: 32.7kHz; FREQ-TOLERANCE: 20 ppm; MF: ECS; MPN: ECS-.327-7-34B-TR
X3 = MainBoard:ASEM1: ASEM1 Series Oscillator Compact SMD MEMS clock oscillator in 3.2 x 2.5 x 0.85 mm plastic package. Source: http://www.abracon.com/Oscillators/ASEM.pdf; DIGI-KEY#: 535-9774-1-ND; FREQ: 50 MHz; FREQ-STABILITY: 50 ppm; MF: Abracon; MPN: ASEM1-50.000MHZ-LC-T
X4 = MainBoard:ECX-42: ECX-42 Compact SMD crystal in 4 x 2.5 x 0.8 mm ceramic package. Source: http://www.ecsxtal.com/store/pdf/ECX_42.pdf Note: Device has two GND pins named DGND; CLOAD: 9 pF; DIGI-KEY#: XC1608CT-ND; FREQ-STABILITY: 10 ppm; FREQ-TOLERANCE: 10 ppm; MF: ECS; MPN: ECS-120-9-42-CKM-TR